# Altium project MEGAphone.PrjPcb (part 1 of 2)
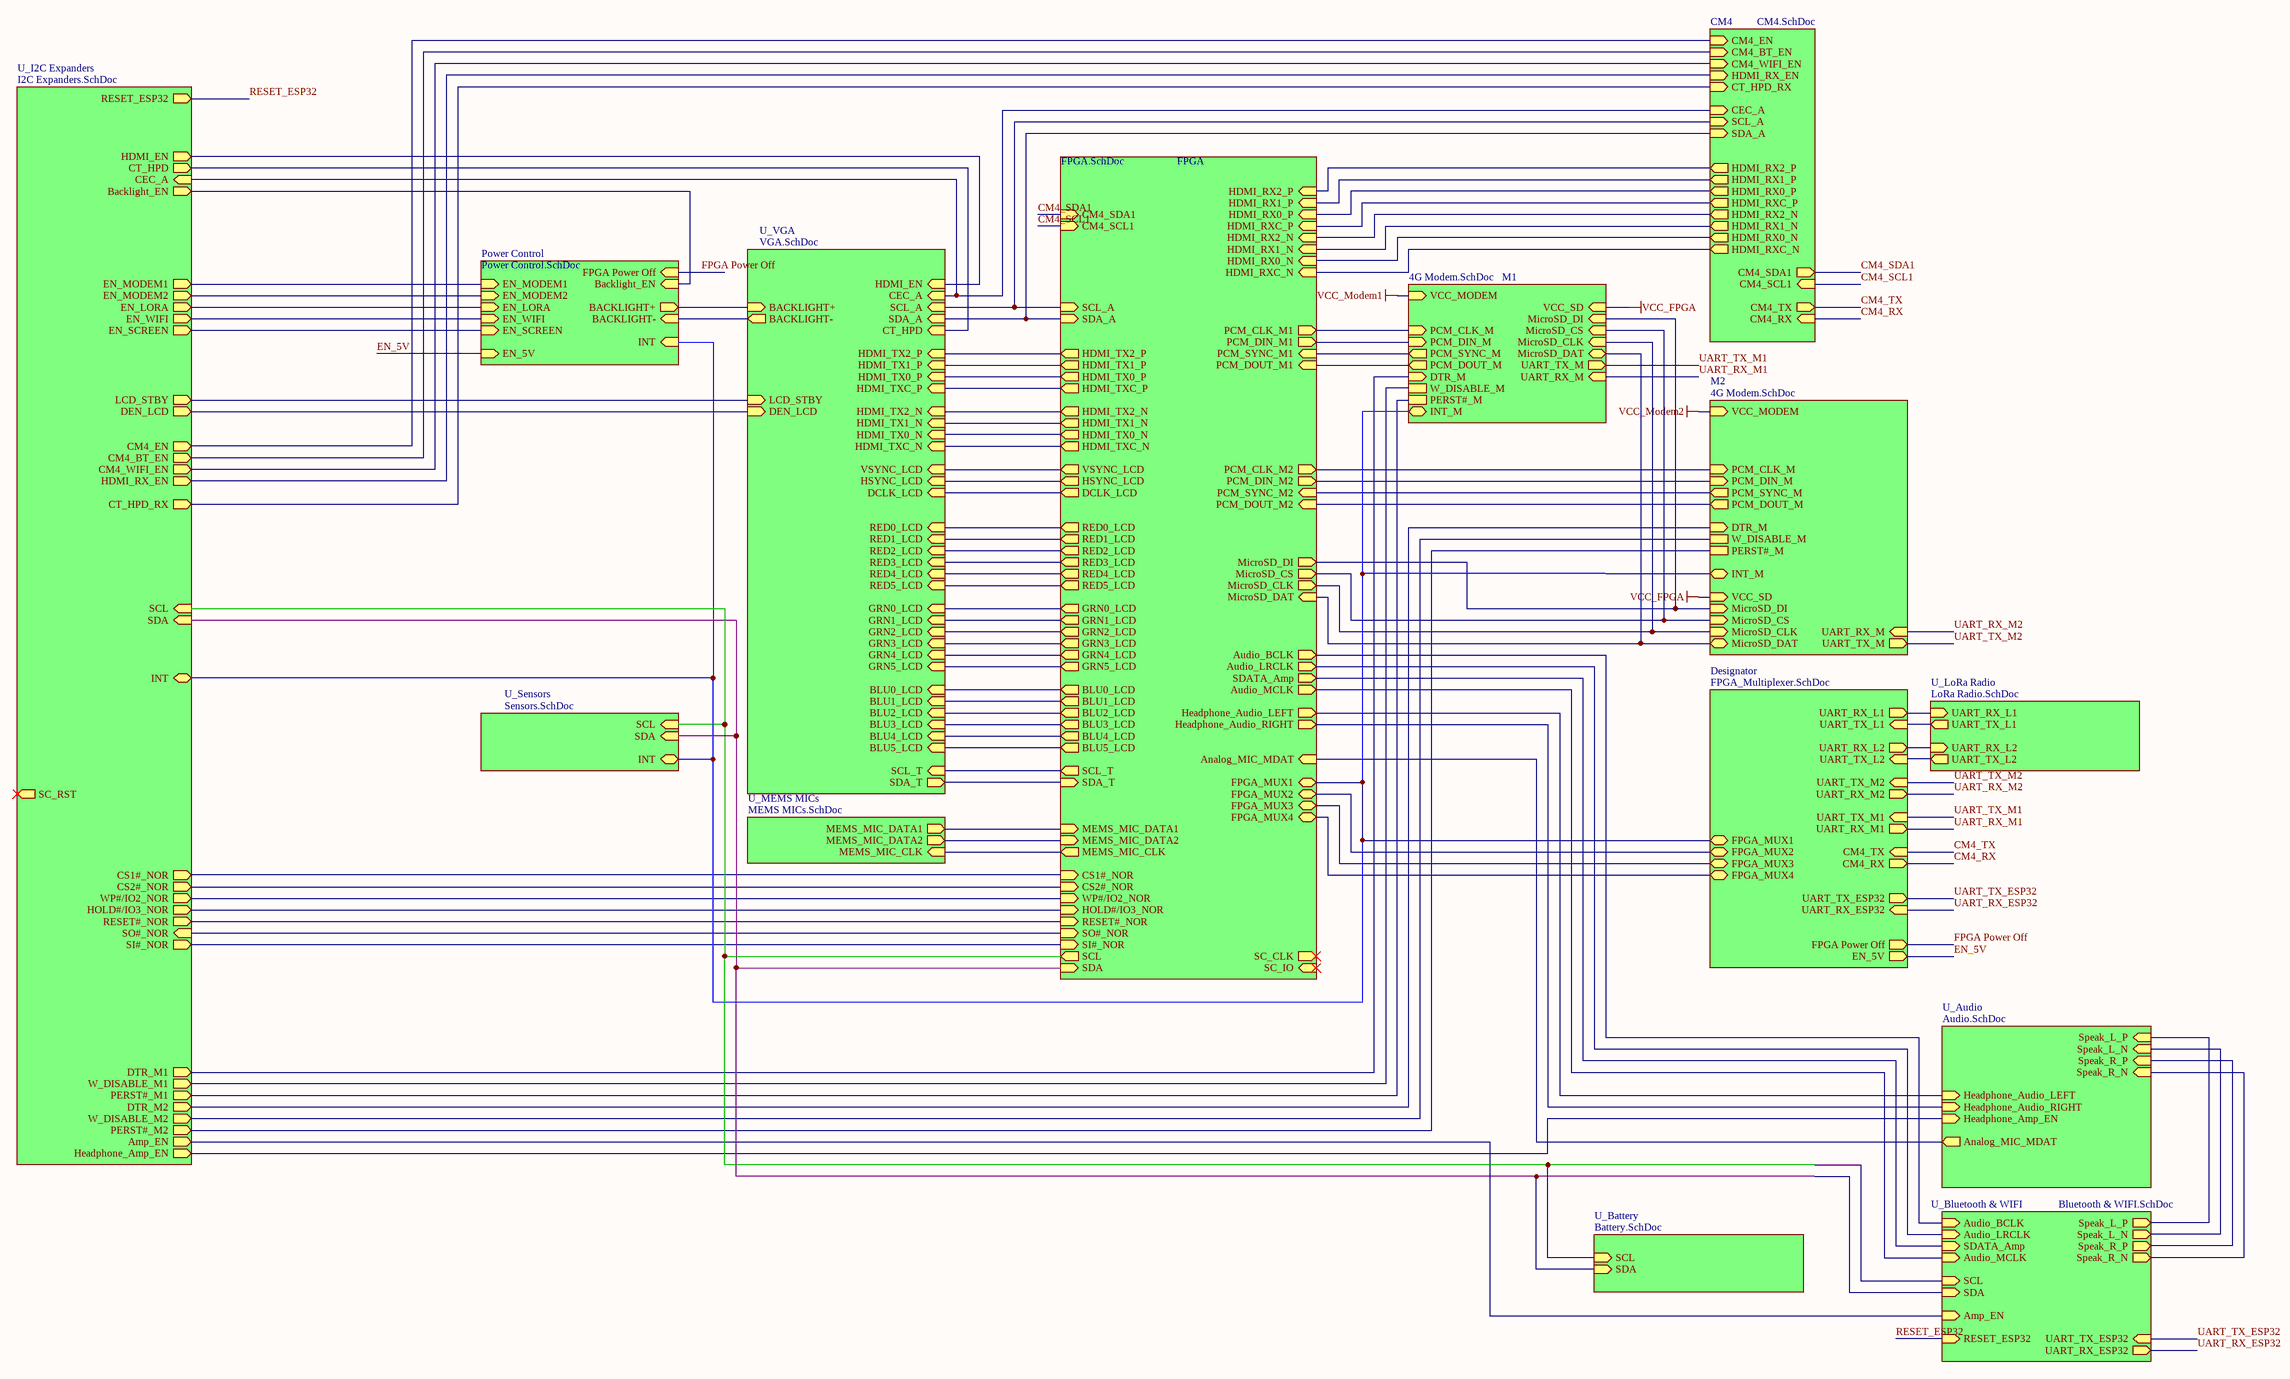
[diagram p0: MEGAphone Overview.SchDoc]
17 sheets, 319 parts. Net scope: hierarchical (ports join the sheet entries above them; power ports are global).
Board file: MEGAphone.PcbDoc
Sheets:
  MEGAphone Overview.SchDoc
    FPGA = FPGA.SchDoc
    U_VGA = VGA.SchDoc
    U_Battery = Battery.SchDoc
    Power Control = Power Control.SchDoc
      PS1 = PowerSupply.SchDoc
      PS2 = PowerSupply.SchDoc
      PS3 = PowerSupply.SchDoc
      PS5 = PowerSupply.SchDoc
      PS6 = PowerSupply.SchDoc
      PS7 5V = PowerSupply5V.SchDoc
      PS4 = PowerSupply5V.SchDoc
    U_I2C Expanders = I2C Expanders.SchDoc
    U_MEMS MICs = MEMS MICs.SchDoc
    U_Audio = Audio.SchDoc
      FA = Headphone Filter.SchDoc
      FB = Headphone Filter.SchDoc
    M1 = 4G Modem.SchDoc
    M2 = 4G Modem.SchDoc
    U_LoRa Radio = LoRa Radio.SchDoc
    U_Bluetooth & WIFI = Bluetooth & WIFI.SchDoc
    U_Sensors = Sensors.SchDoc
    CM4 = CM4.SchDoc
    Designator = FPGA_Multiplexer.SchDoc

## Sheet MEGAphone Overview.SchDoc: Mega Phone
size A2; DrawnBy: D Kleiss; Organization: Flinders University; Address1: College of Science & Engineering; Address2: Engineering Services Room 3.22; Address3: 1284 South Rd; Address4: SA 5042; DocumentNumber: A4284; Revision: 1; SheetNumber: 1; SheetTotal: 1; ProjectName: Mega Phone

### Sub-sheets
CM4 = CM4.SchDoc: HDMI_RXC_N (out), HDMI_RX0_N (out), HDMI_RX1_N (out), HDMI_RX2_N (out), HDMI_RX0_P (out), HDMI_RX2_P (out), HDMI_RX1_P (out), HDMI_RXC_P (out), CM4_RX (in), CM4_TX (out), SDA_A (in), SCL_A (in), CEC_A (in), CM4_EN (in), CM4_BT_EN (in), CM4_WIFI_EN (in), HDMI_RX_EN (in), CT_HPD_RX (in), CM4_SDA1 (out), CM4_SCL1 (in)
Designator = FPGA_Multiplexer.SchDoc: FPGA_MUX1 (bidir), FPGA_MUX2 (bidir), FPGA_MUX3 (bidir), FPGA_MUX4 (bidir), UART_RX_L1 (out), UART_TX_L1 (in), UART_RX_L2 (out), UART_TX_L2 (in), UART_TX_M2 (in), UART_RX_M2 (out), UART_TX_M1 (in), UART_RX_M1 (out), CM4_RX (out), CM4_TX (in), UART_TX_ESP32 (out), UART_RX_ESP32 (in), FPGA Power Off (out), EN_5V (out)
FPGA = FPGA.SchDoc: DCLK_LCD (out), HSYNC_LCD (out), BLU0_LCD (out), BLU1_LCD (out), BLU2_LCD (out), BLU3_LCD (out), BLU4_LCD (out), BLU5_LCD (out), GRN0_LCD (out), GRN1_LCD (out), GRN2_LCD (out), GRN3_LCD (out), GRN4_LCD (out), GRN5_LCD (out), Audio_MCLK (out), Analog_MIC_MDAT (in), Audio_BCLK (out), Audio_LRCLK (out), VSYNC_LCD (out), RED0_LCD (out), RED1_LCD (out), RED2_LCD (out), RED3_LCD (out), RED4_LCD (out), RED5_LCD (out), PCM_CLK_M1 (out), PCM_DOUT_M1 (in), PCM_DIN_M1 (out), PCM_SYNC_M1 (in), PCM_CLK_M2 (out), PCM_DOUT_M2 (in), PCM_DIN_M2 (out), PCM_SYNC_M2 (in), Headphone_Audio_RIGHT (out), Headphone_Audio_LEFT (out), MEMS_MIC_DATA2 (in), MEMS_MIC_DATA1 (in), MEMS_MIC_CLK (out), SDATA_Amp (out), SC_CLK (out), SC_IO (in), SDA (in), SCL (out), SDA_T (in), SCL_T (out), MicroSD_CS (out), MicroSD_DAT (in), MicroSD_CLK (out), MicroSD_DI (out), CS1#_NOR (in), HOLD#/IO3_NOR (in), RESET#_NOR (in), WP#/IO2_NOR (in), CS2#_NOR (in), HDMI_TXC_N (out), HDMI_TX0_N (out), HDMI_TX1_N (out), HDMI_TX2_N (out), HDMI_TX0_P (out), HDMI_TX2_P (out), HDMI_TX1_P (out), SDA_A (in), SCL_A (in), HDMI_TXC_P (out), HDMI_RXC_N (in), HDMI_RX0_N (in), HDMI_RX1_N (in), HDMI_RX2_N (in), HDMI_RX0_P (in), HDMI_RX2_P (in), HDMI_RX1_P (in), HDMI_RXC_P (in), SI#_NOR (in), SO#_NOR (in), FPGA_MUX1 (bidir), FPGA_MUX2 (bidir), FPGA_MUX3 (bidir), FPGA_MUX4 (bidir), CM4_SDA1 (in), CM4_SCL1 (in)
M1 = 4G Modem.SchDoc: UART_RX_M (in), UART_TX_M (out), DTR_M (in), PCM_CLK_M (in), PCM_DOUT_M (out), PCM_DIN_M (in), PCM_SYNC_M (out), W_DISABLE_M, PERST#_M, INT_M (bidir), MicroSD_CLK (in), MicroSD_DI (in), MicroSD_DAT (bidir), MicroSD_CS (in), VCC_MODEM (in), VCC_SD (in)
M2 = 4G Modem.SchDoc: UART_RX_M (in), UART_TX_M (out), DTR_M (in), PCM_CLK_M (in), PCM_DOUT_M (out), PCM_DIN_M (in), PCM_SYNC_M (out), W_DISABLE_M, PERST#_M, INT_M (bidir), MicroSD_CLK (in), MicroSD_DI (in), MicroSD_DAT (bidir), MicroSD_CS (in), VCC_MODEM (in), VCC_SD (in)
Power Control = Power Control.SchDoc: FPGA Power Off (in), INT (in), EN_MODEM1 (in), EN_MODEM2 (in), EN_LORA (in), EN_WIFI (in), EN_SCREEN (in), BACKLIGHT+ (out), BACKLIGHT- (in), Backlight_EN (in), EN_5V (in)
U_Audio = Audio.SchDoc: Analog_MIC_MDAT (out), Headphone_Amp_EN (in), Headphone_Audio_LEFT (in), Headphone_Audio_RIGHT (in), Speak_L_P (in), Speak_L_N (in), Speak_R_P (in), Speak_R_N (in)
U_Battery = Battery.SchDoc: SCL (in), SDA (in)
U_Bluetooth & WIFI = Bluetooth & WIFI.SchDoc: UART_RX_ESP32 (out), UART_TX_ESP32 (in), RESET_ESP32 (in), Speak_L_P (out), Speak_L_N (out), Speak_R_P (out), Speak_R_N (out), Audio_BCLK (in), Audio_LRCLK (in), SDATA_Amp (in), Audio_MCLK (in), SCL (in), SDA (in), Amp_EN (in)
U_I2C Expanders = I2C Expanders.SchDoc: HOLD#/IO3_NOR (out), RESET#_NOR (out), CS2#_NOR (out), CS1#_NOR (out), WP#/IO2_NOR (out), DTR_M1 (out), PERST#_M1 (out), DTR_M2 (out), PERST#_M2 (out), W_DISABLE_M2 (out), W_DISABLE_M1 (out), Headphone_Amp_EN (out), EN_MODEM1 (out), EN_MODEM2 (out), EN_LORA (out), EN_WIFI (out), EN_SCREEN (out), INT (bidir), SCL (in), SC_RST (out), SDA (in), LCD_STBY (out), CM4_EN (out), CM4_BT_EN (out), CM4_WIFI_EN (out), HDMI_RX_EN (out), HDMI_EN (out), CT_HPD (out), CEC_A (in), Backlight_EN (out), DEN_LCD (out), RESET_ESP32 (out), CT_HPD_RX (out), SI#_NOR (out), SO#_NOR (in), Amp_EN (out)
U_LoRa Radio = LoRa Radio.SchDoc: UART_RX_L1 (in), UART_TX_L1 (out), UART_RX_L2 (in), UART_TX_L2 (out)
U_MEMS MICs = MEMS MICs.SchDoc: MEMS_MIC_DATA1 (out), MEMS_MIC_DATA2 (out), MEMS_MIC_CLK (in)
U_Sensors = Sensors.SchDoc: SDA (in), SCL (in), INT (bidir)
U_VGA = VGA.SchDoc: DCLK_LCD (in), DEN_LCD (in), HSYNC_LCD (in), BLU0_LCD (in), BLU1_LCD (in), BLU2_LCD (in), BLU3_LCD (in), BLU4_LCD (in), BLU5_LCD (in), GRN0_LCD (in), GRN1_LCD (in), GRN2_LCD (in), GRN3_LCD (in), GRN4_LCD (in), GRN5_LCD (in), VSYNC_LCD (in), RED0_LCD (in), RED1_LCD (in), RED2_LCD (in), RED3_LCD (in), RED4_LCD (in), RED5_LCD (in), BACKLIGHT- (out), BACKLIGHT+ (in), SCL_T (in), SDA_T (out), LCD_STBY (in), HDMI_TXC_N (in), HDMI_TX0_N (in), HDMI_TX1_N (in), HDMI_TX2_N (in), HDMI_TXC_P (in), HDMI_TX0_P (in), HDMI_TX2_P (in), HDMI_TX1_P (in), CT_HPD (in), SDA_A (in), SCL_A (in), CEC_A (in), HDMI_EN (in)

### Nets
VCC_FPGA: sheet M1/VCC_SD, sheet M2/VCC_SD
CEC_A: sheet U_VGA/CEC_A, sheet U_I2C Expanders/CEC_A, sheet CM4/CEC_A
CM4_RX: sheet CM4/CM4_RX, sheet Designator/CM4_RX
CM4_SCL1: sheet FPGA/CM4_SCL1, sheet CM4/CM4_SCL1
CM4_SDA1: sheet FPGA/CM4_SDA1, sheet CM4/CM4_SDA1
CM4_TX: sheet CM4/CM4_TX, sheet Designator/CM4_TX
CT_HPD: sheet U_VGA/CT_HPD, sheet U_I2C Expanders/CT_HPD
EN_5V: sheet Power Control/EN_5V, sheet Designator/EN_5V
FPGA Power Off: sheet Power Control/FPGA Power Off, sheet Designator/FPGA Power Off
HDMI_EN: sheet U_VGA/HDMI_EN, sheet U_I2C Expanders/HDMI_EN
HDMI_TX0_N: sheet FPGA/HDMI_TX0_N, sheet U_VGA/HDMI_TX0_N
HDMI_TX0_P: sheet FPGA/HDMI_TX0_P, sheet U_VGA/HDMI_TX0_P
HDMI_TX1_N: sheet FPGA/HDMI_TX1_N, sheet U_VGA/HDMI_TX1_N
HDMI_TX1_P: sheet FPGA/HDMI_TX1_P, sheet U_VGA/HDMI_TX1_P
HDMI_TX2_N: sheet FPGA/HDMI_TX2_N, sheet U_VGA/HDMI_TX2_N
HDMI_TX2_P: sheet FPGA/HDMI_TX2_P, sheet U_VGA/HDMI_TX2_P
HDMI_TXC_N: sheet FPGA/HDMI_TXC_N, sheet U_VGA/HDMI_TXC_N
HDMI_TXC_P: sheet FPGA/HDMI_TXC_P, sheet U_VGA/HDMI_TXC_P
INT: sheet FPGA/FPGA_MUX1, sheet Power Control/INT, sheet U_I2C Expanders/INT, sheet M1/INT_M, sheet M2/INT_M, sheet U_Sensors/INT, sheet Designator/FPGA_MUX1
RESET_ESP32: sheet U_I2C Expanders/RESET_ESP32, sheet U_Bluetooth & WIFI/RESET_ESP32
SCL: sheet FPGA/SCL, sheet U_Battery/SCL, sheet U_I2C Expanders/SCL, sheet U_Bluetooth & WIFI/SCL, sheet U_Sensors/SCL
SCL_A: sheet FPGA/SCL_A, sheet U_VGA/SCL_A, sheet CM4/SCL_A
SDA: sheet FPGA/SDA, sheet U_Battery/SDA, sheet U_I2C Expanders/SDA, sheet U_Bluetooth & WIFI/SDA, sheet U_Sensors/SDA
SDA_A: sheet FPGA/SDA_A, sheet U_VGA/SDA_A, sheet CM4/SDA_A
UART_RX_ESP32: sheet U_Bluetooth & WIFI/UART_RX_ESP32, sheet Designator/UART_RX_ESP32
UART_RX_M1: sheet M1/UART_RX_M, sheet Designator/UART_RX_M1
UART_RX_M2: sheet M2/UART_RX_M, sheet Designator/UART_RX_M2
UART_TX_ESP32: sheet U_Bluetooth & WIFI/UART_TX_ESP32, sheet Designator/UART_TX_ESP32
UART_TX_M1: sheet M1/UART_TX_M, sheet Designator/UART_TX_M1
UART_TX_M2: sheet M2/UART_TX_M, sheet Designator/UART_TX_M2
NetC36_1: sheet U_VGA/BACKLIGHT+, sheet Power Control/BACKLIGHT+
NetC39_1: sheet U_VGA/BACKLIGHT-, sheet Power Control/BACKLIGHT-
NetCM1_89: sheet U_I2C Expanders/CM4_WIFI_EN, sheet CM4/CM4_WIFI_EN
NetCM1_91: sheet U_I2C Expanders/CM4_BT_EN, sheet CM4/CM4_BT_EN
NetCM1_99: sheet U_I2C Expanders/CM4_EN, sheet CM4/CM4_EN
NetCM1_170: sheet FPGA/HDMI_RX2_P, sheet CM4/HDMI_RX2_P
NetCM1_172: sheet FPGA/HDMI_RX2_N, sheet CM4/HDMI_RX2_N
NetCM1_176: sheet FPGA/HDMI_RX1_P, sheet CM4/HDMI_RX1_P
NetCM1_178: sheet FPGA/HDMI_RX1_N, sheet CM4/HDMI_RX1_N
NetCM1_182: sheet FPGA/HDMI_RX0_P, sheet CM4/HDMI_RX0_P
NetCM1_184: sheet FPGA/HDMI_RX0_N, sheet CM4/HDMI_RX0_N
NetCM1_188: sheet FPGA/HDMI_RXC_P, sheet CM4/HDMI_RXC_P
NetCM1_190: sheet FPGA/HDMI_RXC_N, sheet CM4/HDMI_RXC_N
NetESP1_5: sheet U_I2C Expanders/Amp_EN, sheet U_Bluetooth & WIFI/Amp_EN
NetESP1_8: sheet U_Audio/Speak_L_P, sheet U_Bluetooth & WIFI/Speak_L_P
NetESP1_9: sheet FPGA/Audio_BCLK, sheet U_Bluetooth & WIFI/Audio_BCLK
NetESP1_10: sheet U_Audio/Speak_L_N, sheet U_Bluetooth & WIFI/Speak_L_N
NetESP1_11: sheet FPGA/Audio_LRCLK, sheet U_Bluetooth & WIFI/Audio_LRCLK
NetESP1_12: sheet U_Audio/Speak_R_P, sheet U_Bluetooth & WIFI/Speak_R_P
NetESP1_13: sheet FPGA/SDATA_Amp, sheet U_Bluetooth & WIFI/SDATA_Amp
NetESP1_14: sheet U_Audio/Speak_R_N, sheet U_Bluetooth & WIFI/Speak_R_N
NetESP1_15: sheet FPGA/Audio_MCLK, sheet U_Bluetooth & WIFI/Audio_MCLK
NetJ1_M1_5: sheet FPGA/MicroSD_CLK, sheet M1/MicroSD_CLK, sheet M2/MicroSD_CLK
NetJ1_M1_8: sheet FPGA/MicroSD_DAT, sheet FPGA/MicroSD_DI, sheet M1/MicroSD_DI, sheet M1/MicroSD_DAT, sheet M2/MicroSD_DI, sheet M2/MicroSD_DAT
NetJ1_M1_18: sheet FPGA/MicroSD_CS, sheet M1/MicroSD_CS, sheet M2/MicroSD_CS
NetP3_1: sheet FPGA/SCL_T, sheet U_VGA/SCL_T
NetP3_2: sheet FPGA/SDA_T, sheet U_VGA/SDA_T
NetR17_FA_2: sheet FPGA/Headphone_Audio_LEFT, sheet U_Audio/Headphone_Audio_LEFT
NetR17_FB_2: sheet FPGA/Headphone_Audio_RIGHT, sheet U_Audio/Headphone_Audio_RIGHT
NetR39_1: sheet FPGA/MEMS_MIC_DATA1, sheet U_MEMS MICs/MEMS_MIC_DATA1
NetR41_1: sheet FPGA/MEMS_MIC_CLK, sheet U_MEMS MICs/MEMS_MIC_CLK
NetR42_1: sheet FPGA/MEMS_MIC_DATA2, sheet U_MEMS MICs/MEMS_MIC_DATA2
NetR76_2: sheet U_VGA/LCD_STBY, sheet U_I2C Expanders/LCD_STBY
NetRF1_7: sheet U_LoRa Radio/UART_RX_L2, sheet Designator/UART_RX_L2
NetRF1_9: sheet U_LoRa Radio/UART_TX_L2, sheet Designator/UART_TX_L2
NetRF2_7: sheet U_LoRa Radio/UART_RX_L1, sheet Designator/UART_RX_L1
NetRF2_9: sheet U_LoRa Radio/UART_TX_L1, sheet Designator/UART_TX_L1
NetS5_1: sheet Power Control/EN_MODEM1, sheet U_I2C Expanders/EN_MODEM1
NetS7_1: sheet Power Control/EN_MODEM2, sheet U_I2C Expanders/EN_MODEM2
NetS9_1: sheet Power Control/EN_LORA, sheet U_I2C Expanders/EN_LORA
NetS10_1: sheet Power Control/EN_WIFI, sheet U_I2C Expanders/EN_WIFI
NetU1_M1_20: sheet U_I2C Expanders/W_DISABLE_M1, sheet M1/W_DISABLE_M
NetU1_M1_22: sheet U_I2C Expanders/PERST#_M1, sheet M1/PERST#_M
NetU1_M1_31: sheet U_I2C Expanders/DTR_M1, sheet M1/DTR_M
NetU1_M2_20: sheet U_I2C Expanders/W_DISABLE_M2, sheet M2/W_DISABLE_M
NetU1_M2_22: sheet U_I2C Expanders/PERST#_M2, sheet M2/PERST#_M
NetU1_M2_31: sheet U_I2C Expanders/DTR_M2, sheet M2/DTR_M
NetU4_M1_11: sheet FPGA/PCM_SYNC_M1, sheet M1/PCM_SYNC_M
NetU4_M1_12: sheet FPGA/PCM_DIN_M1, sheet M1/PCM_DIN_M
NetU4_M1_13: sheet FPGA/PCM_DOUT_M1, sheet M1/PCM_DOUT_M
NetU4_M1_14: sheet FPGA/PCM_CLK_M1, sheet M1/PCM_CLK_M
NetU4_M2_11: sheet FPGA/PCM_SYNC_M2, sheet M2/PCM_SYNC_M
NetU4_M2_12: sheet FPGA/PCM_DIN_M2, sheet M2/PCM_DIN_M
NetU4_M2_13: sheet FPGA/PCM_DOUT_M2, sheet M2/PCM_DOUT_M
NetU4_M2_14: sheet FPGA/PCM_CLK_M2, sheet M2/PCM_CLK_M
NetU5_6: sheet FPGA/Analog_MIC_MDAT, sheet U_Audio/Analog_MIC_MDAT
NetU9_10A: sheet FPGA/FPGA_MUX2, sheet Designator/FPGA_MUX2
NetU9_11A: sheet FPGA/FPGA_MUX3, sheet Designator/FPGA_MUX3
NetU9_12A: sheet FPGA/FPGA_MUX4, sheet Designator/FPGA_MUX4
NetU9_12B: sheet FPGA/VSYNC_LCD, sheet U_VGA/VSYNC_LCD
NetU9_13B: sheet FPGA/HSYNC_LCD, sheet U_VGA/HSYNC_LCD
NetU9_14B: sheet FPGA/DCLK_LCD, sheet U_VGA/DCLK_LCD
NetU9_15B: sheet FPGA/BLU5_LCD, sheet U_VGA/BLU5_LCD
NetU9_16B: sheet FPGA/BLU4_LCD, sheet U_VGA/BLU4_LCD
NetU9_17B: sheet FPGA/BLU3_LCD, sheet U_VGA/BLU3_LCD
NetU9_18B: sheet FPGA/BLU2_LCD, sheet U_VGA/BLU2_LCD
NetU9_19B: sheet FPGA/BLU1_LCD, sheet U_VGA/BLU1_LCD
NetU9_20B: sheet FPGA/BLU0_LCD, sheet U_VGA/BLU0_LCD
NetU9_21B: sheet FPGA/GRN5_LCD, sheet U_VGA/GRN5_LCD
NetU9_22B: sheet FPGA/GRN4_LCD, sheet U_VGA/GRN4_LCD
NetU9_23B: sheet FPGA/GRN3_LCD, sheet U_VGA/GRN3_LCD
NetU9_24B: sheet FPGA/GRN2_LCD, sheet U_VGA/GRN2_LCD
NetU9_25B: sheet FPGA/GRN1_LCD, sheet U_VGA/GRN1_LCD
NetU9_26B: sheet FPGA/GRN0_LCD, sheet U_VGA/GRN0_LCD
NetU9_27B: sheet FPGA/RED5_LCD, sheet U_VGA/RED5_LCD
NetU9_28B: sheet FPGA/RED4_LCD, sheet U_VGA/RED4_LCD
NetU9_29B: sheet FPGA/RED3_LCD, sheet U_VGA/RED3_LCD
NetU9_30B: sheet FPGA/RED2_LCD, sheet U_VGA/RED2_LCD
NetU9_31B: sheet FPGA/RED1_LCD, sheet U_VGA/RED1_LCD
NetU9_32B: sheet FPGA/RED0_LCD, sheet U_VGA/RED0_LCD
NetU10_1: sheet FPGA/HOLD#/IO3_NOR, sheet U_I2C Expanders/HOLD#/IO3_NOR
NetU10_3: sheet FPGA/RESET#_NOR, sheet U_I2C Expanders/RESET#_NOR
NetU10_6: sheet FPGA/CS2#_NOR, sheet U_I2C Expanders/CS2#_NOR
NetU10_7: sheet FPGA/CS1#_NOR, sheet U_I2C Expanders/CS1#_NOR
NetU10_8: sheet FPGA/SO#_NOR, sheet U_I2C Expanders/SO#_NOR
NetU10_9: sheet FPGA/WP#/IO2_NOR, sheet U_I2C Expanders/WP#/IO2_NOR
NetU10_15: sheet FPGA/SI#_NOR, sheet U_I2C Expanders/SI#_NOR
NetU11_FA_5: sheet U_I2C Expanders/Headphone_Amp_EN, sheet U_Audio/Headphone_Amp_EN
NetU12_10: sheet U_I2C Expanders/HDMI_RX_EN, sheet CM4/HDMI_RX_EN
NetU13_7: sheet U_VGA/DEN_LCD, sheet U_I2C Expanders/DEN_LCD
NetU13_8: sheet Power Control/Backlight_EN, sheet U_I2C Expanders/Backlight_EN
NetU14_8: sheet Power Control/EN_SCREEN, sheet U_I2C Expanders/EN_SCREEN
NetU14_19: sheet U_I2C Expanders/CT_HPD_RX, sheet CM4/CT_HPD_RX

### Notes on the sheet
- Title
- Size:
- Date:
- File:
- A2
- Number:
- Time:
- Revision:
- Sheet
- of

## Sheet FPGA.SchDoc: MEGAPHONE FPGA
size A3; SheetNumber: 2
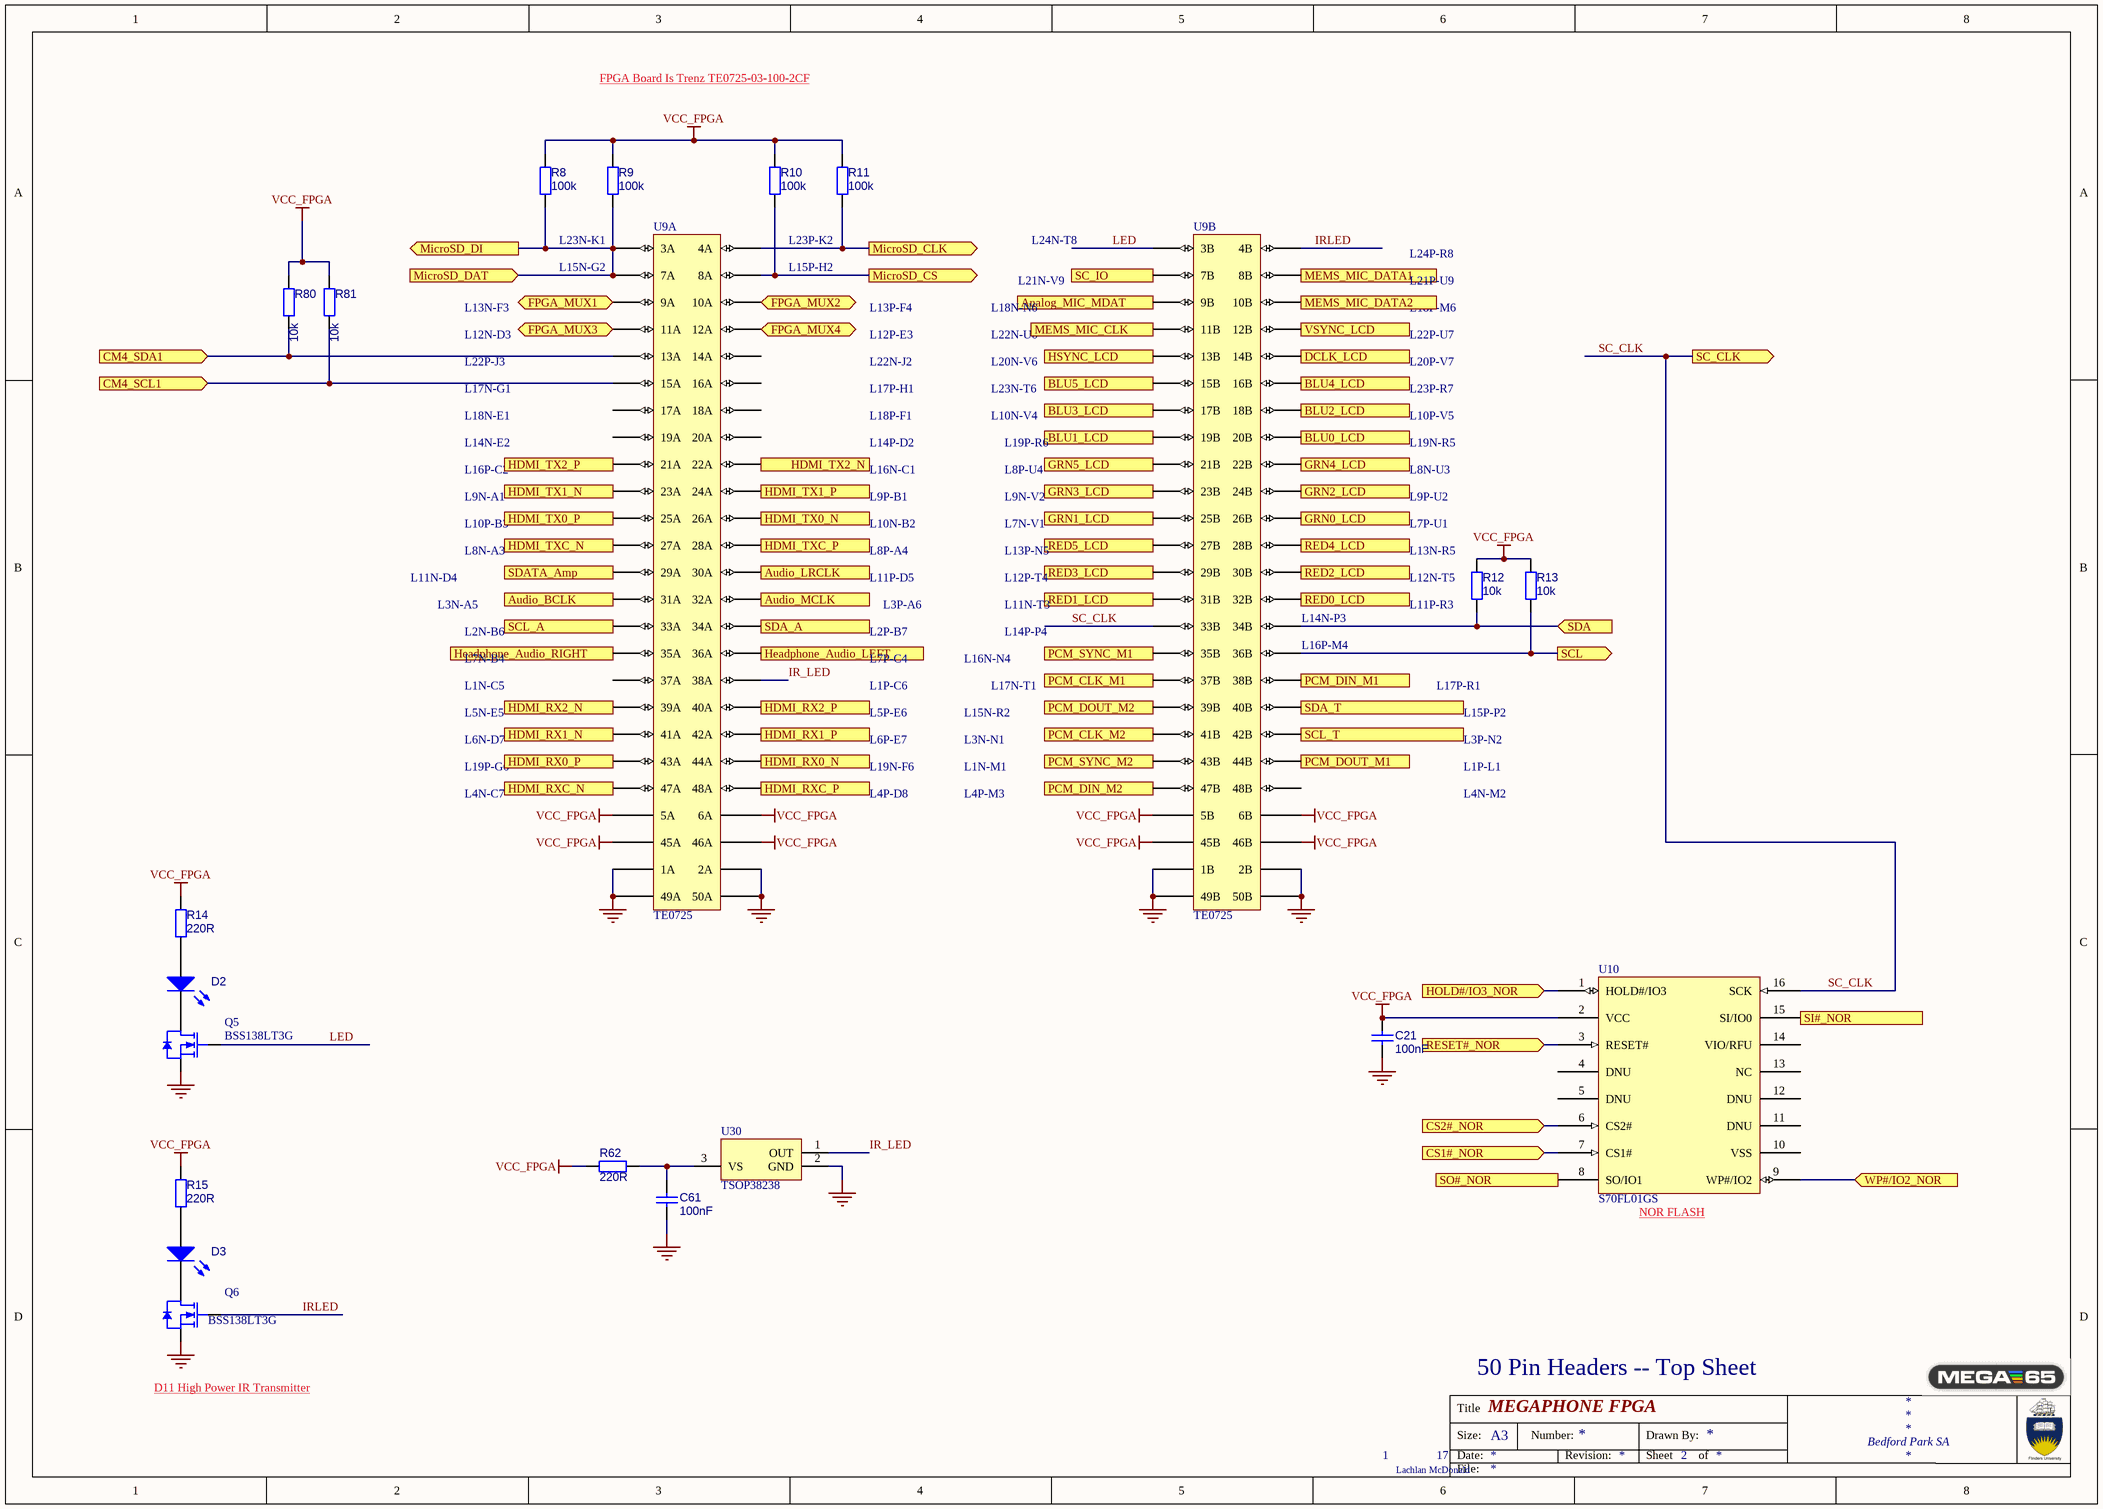
[diagram p1: FPGA.SchDoc]

### Parts
C21  100nF  [0603_CAP UF HD]
C61  100nF  [0603_CAP UF HD]
D2  (no value)  [LED 3mm Red]
D3  (no value)  [LED 3mm Red]
Q5  BSS138LT3G  [SOT-23]
Q6  BSS138LT3G  [SOT-23]
R8  100k  [0603-RESISTOR HD]
R9  100k  [0603-RESISTOR HD]
R10  100k  [0603-RESISTOR HD]
R11  100k  [0603-RESISTOR HD]
R12  10k  [0603-RESISTOR HD]
R13  10k  [0603-RESISTOR HD]
R14  220R  [0603-RESISTOR HD]
R15  220R  [0603-RESISTOR HD]
R62  220R  [0603-RESISTOR HD]
R80  10k  [0603-RESISTOR HD]
R81  10k  [0603-RESISTOR HD]
U9  TE0725  [Trenz TE-0725]  (parts A,B of 2)
U10  S70FL01GS  [S70FL01GS]
U30  TSOP38238  [VISH-TSOP38238]

### Ports
Analog_MIC_MDAT (in), Audio_BCLK (out), Audio_LRCLK (out), Audio_MCLK (out), BLU0_LCD (out), BLU1_LCD (out), BLU2_LCD (out), BLU3_LCD (out), BLU4_LCD (out), BLU5_LCD (out), CM4_SCL1 (in), CM4_SDA1 (in), CS1#_NOR (in), CS2#_NOR (in), DCLK_LCD (out), FPGA_MUX1 (bidir), FPGA_MUX2 (bidir), FPGA_MUX3 (bidir), FPGA_MUX4 (bidir), GRN0_LCD (out), GRN1_LCD (out), GRN2_LCD (out), GRN3_LCD (out), GRN4_LCD (out), GRN5_LCD (out), HDMI_RX0_N (in), HDMI_RX0_P (in), HDMI_RX1_N (in), HDMI_RX1_P (in), HDMI_RX2_N (in), HDMI_RX2_P (in), HDMI_RXC_N (in), HDMI_RXC_P (in), HDMI_TX0_N (out), HDMI_TX0_P (out), HDMI_TX1_N (out), HDMI_TX1_P (out), HDMI_TX2_N (out), HDMI_TX2_P (out), HDMI_TXC_N (out), HDMI_TXC_P (out), Headphone_Audio_LEFT (out), Headphone_Audio_RIGHT (out), HOLD#/IO3_NOR (in), HSYNC_LCD (out), MEMS_MIC_CLK (out), MEMS_MIC_DATA1 (in), MEMS_MIC_DATA2 (in), MicroSD_CLK (out), MicroSD_CS (out), MicroSD_DAT (in), MicroSD_DI (out), PCM_CLK_M1 (out), PCM_CLK_M2 (out), PCM_DIN_M1 (out), PCM_DIN_M2 (out), PCM_DOUT_M1 (in), PCM_DOUT_M2 (in), PCM_SYNC_M1 (in), PCM_SYNC_M2 (in), RED0_LCD (out), RED1_LCD (out), RED2_LCD (out), RED3_LCD (out), RED4_LCD (out), RED5_LCD (out), RESET#_NOR (in), SC_CLK (out), SC_IO (in), SCL (out), SCL_A (out), SCL_T (out), SDA (in), SDA_A (out), SDA_T (in), SDATA_Amp (out), SI#_NOR (in), SO#_NOR (out), VSYNC_LCD (out), WP#/IO2_NOR (in)

### Nets
GND: C21.2 C61.2 Q5.2(S) Q6.2(S) U9.1A U9.1B U9.2A U9.2B U9.49A U9.49B U9.50A U9.50B U30.2(GND)
VCC_FPGA: C21.1 R8.1 R9.1 R10.1 R11.1 R12.1 R13.1 R14.1 R15.1 R62.1 R80.1 R81.1 U9.5A U9.5B U9.6A U9.6B U9.45A U9.45B U9.46A U9.46B U10.2(VCC)
CM4_SCL1: R81.2 U9.15A ; port CM4_SCL1
CM4_SDA1: R80.2 U9.13A ; port CM4_SDA1
HDMI_TX0_N: U9.26A ; port HDMI_TX0_N
HDMI_TX0_P: U9.25A ; port HDMI_TX0_P
HDMI_TX1_N: U9.23A ; port HDMI_TX1_N
HDMI_TX1_P: U9.24A ; port HDMI_TX1_P
HDMI_TX2_N: U9.22A ; port HDMI_TX2_N
HDMI_TX2_P: U9.21A ; port HDMI_TX2_P
HDMI_TXC_N: U9.27A ; port HDMI_TXC_N
HDMI_TXC_P: U9.28A ; port HDMI_TXC_P
INT: U9.9A ; port FPGA_MUX1
IR_LED: U9.38A U30.1(OUT)
IRLED: Q6.1(G) U9.4B
LED: Q5.1(G) U9.3B
SC_CLK: U9.33B U10.16(SCK) ; port SC_CLK
SCL: R13.2 U9.36B ; port SCL
SCL_A: U9.33A ; port SCL_A
SDA: R12.2 U9.34B ; port SDA
SDA_A: U9.34A ; port SDA_A
NetC61_1: C61.1 R62.2 U30.3(VS)
NetCM1_170: U9.40A ; port HDMI_RX2_P
NetCM1_172: U9.39A ; port HDMI_RX2_N
NetCM1_176: U9.42A ; port HDMI_RX1_P
NetCM1_178: U9.41A ; port HDMI_RX1_N
NetCM1_182: U9.43A ; port HDMI_RX0_P
NetCM1_184: U9.44A ; port HDMI_RX0_N
NetCM1_188: U9.48A ; port HDMI_RXC_P
NetCM1_190: U9.47A ; port HDMI_RXC_N
NetD2_A: D2.A R14.2
NetD2_K: D2.K Q5.3(D)
NetD3_A: D3.A R15.2
NetD3_K: D3.K Q6.3(D)
NetESP1_9: U9.31A ; port Audio_BCLK
NetESP1_11: U9.30A ; port Audio_LRCLK
NetESP1_13: U9.29A ; port SDATA_Amp
NetESP1_15: U9.32A ; port Audio_MCLK
NetJ1_M1_5: R11.2 U9.4A ; port MicroSD_CLK
NetJ1_M1_8: R8.2 R9.2 U9.3A U9.7A ; port MicroSD_DAT, port MicroSD_DI
NetJ1_M1_18: R10.2 U9.8A ; port MicroSD_CS
NetP3_1: U9.42B ; port SCL_T
NetP3_2: U9.40B ; port SDA_T
NetR17_FA_2: U9.36A ; port Headphone_Audio_LEFT
NetR17_FB_2: U9.35A ; port Headphone_Audio_RIGHT
NetR39_1: U9.8B ; port MEMS_MIC_DATA1
NetR41_1: U9.11B ; port MEMS_MIC_CLK
NetR42_1: U9.10B ; port MEMS_MIC_DATA2
NetU4_M1_11: U9.35B ; port PCM_SYNC_M1
NetU4_M1_12: U9.38B ; port PCM_DIN_M1
NetU4_M1_13: U9.44B ; port PCM_DOUT_M1
NetU4_M1_14: U9.37B ; port PCM_CLK_M1
NetU4_M2_11: U9.43B ; port PCM_SYNC_M2
NetU4_M2_12: U9.47B ; port PCM_DIN_M2
NetU4_M2_13: U9.39B ; port PCM_DOUT_M2
NetU4_M2_14: U9.41B ; port PCM_CLK_M2
NetU5_6: U9.9B ; port Analog_MIC_MDAT
NetU9_7B: U9.7B ; port SC_IO
NetU9_10A: U9.10A ; port FPGA_MUX2
NetU9_11A: U9.11A ; port FPGA_MUX3
NetU9_12A: U9.12A ; port FPGA_MUX4
NetU9_12B: U9.12B ; port VSYNC_LCD
NetU9_13B: U9.13B ; port HSYNC_LCD
NetU9_14B: U9.14B ; port DCLK_LCD
NetU9_15B: U9.15B ; port BLU5_LCD
NetU9_16B: U9.16B ; port BLU4_LCD
NetU9_17B: U9.17B ; port BLU3_LCD
NetU9_18B: U9.18B ; port BLU2_LCD
NetU9_19B: U9.19B ; port BLU1_LCD
NetU9_20B: U9.20B ; port BLU0_LCD
NetU9_21B: U9.21B ; port GRN5_LCD
NetU9_22B: U9.22B ; port GRN4_LCD
NetU9_23B: U9.23B ; port GRN3_LCD
NetU9_24B: U9.24B ; port GRN2_LCD
NetU9_25B: U9.25B ; port GRN1_LCD
NetU9_26B: U9.26B ; port GRN0_LCD
NetU9_27B: U9.27B ; port RED5_LCD
NetU9_28B: U9.28B ; port RED4_LCD
NetU9_29B: U9.29B ; port RED3_LCD
NetU9_30B: U9.30B ; port RED2_LCD
NetU9_31B: U9.31B ; port RED1_LCD
NetU9_32B: U9.32B ; port RED0_LCD
NetU10_1: U10.1(HOLD#/IO3) ; port HOLD#/IO3_NOR
NetU10_3: U10.3(RESET#) ; port RESET#_NOR
NetU10_6: U10.6(CS2#) ; port CS2#_NOR
NetU10_7: U10.7(CS1#) ; port CS1#_NOR
NetU10_8: U10.8(SO/IO1) ; port SO#_NOR
NetU10_9: U10.9(WP#/IO2) ; port WP#/IO2_NOR
NetU10_15: U10.15(SI/IO0) ; port SI#_NOR

Not connected (* = marked no-connect by the designer): U9 14A 16A 17A 18A 19A 20A 37A 48B; U10 4(DNU) 5(DNU) 10(VSS) 11(DNU) 12(DNU) 13(NC) 14(VIO/RFU)

### Notes on the sheet
- FPGA Board Is Trenz TE0725-03-100-2CF
- L23N-K1
- L23P-K2
- L24N-T8
- L13N-F3
- L15N-G2
- L15P-H2
- L13P-F4
- L18N-N6
- L21N-V9
- L24P-R8
- L21P-U9
- L18P-M6
- L12N-D3
- L22P-J3
- L12P-E3
- L22N-J2
- L22N-U6
- L20N-V6
- L22P-U7
- L20P-V7
- L17N-G1
- L18N-E1
- L14N-E2
- L17P-H1
- L18P-F1
- L14P-D2
- L23N-T6
- L10N-V4
- L19P-R6
- L23P-R7
- L10P-V5
- L19N-R5
- L16P-C2
- L9N-A1
- L16N-C1
- L9P-B1
- L8P-U4
- L9N-V2
- L8N-U3
- L9P-U2
- L11N-D4
- L10P-B3
- L8N-A3
- L10N-B2
- L8P-A4
- L11P-D5
- L7N-V1
- L13P-N5
- L12P-T4
- (near R12) L7P-U1
- (near R12) L13N-R5
- (near R12) L12N-T5
- L3N-A5
- L2N-B6
- L2P-B7
- L3P-A6
- L11N-T3
- L14P-P4
- (near U9) L14N-P3
- (near U9) L16P-M4
- (near R12) L11P-R3
- L7N-B4
- L1N-C5
- L5N-E5
- L7P-C4
- L1P-C6
- L5P-E6
- L16N-N4
- L15N-R2
- L17N-T1
- L17P-R1
- L15P-P2
- L6N-D7
- L19P-G6
- L6P-E7
- L19N-F6
- L3N-N1
- L1N-M1
- L3P-N2
- L1P-L1
- L4N-C7
- L4P-D8
- L4P-M3
- L4N-M2
- (near U10) NOR FLASH
- D11 High Power IR Transmitter
- 50 Pin Headers -- Top Sheet
- 1
- 17
- Lachlan McDonald
- Title
- Size:
- Date:
- A3
- Number:
- Revision:
- Sheet
- Drawn By:
- of
- Bedford Park SA
- File:

### Library data of the parts
C21 C61 = Cap: Capacitor; Value: 100nF
D2 D3 = LED: Manufacturer: *; Element 14 Part Number: *
Q5 Q6 = BSS138LT3G: Power MOSFET, 200 mA, 50 V, N-Channel, 3-Pin SOT-23, Pb-Free, Tape and Reel; Manufacturer: On Semiconductor; Element 14 Part Number: 1431319; Manufacturer Number: BSS138LT3G; Digikey Number: BSS138LT3GOSCT-ND
R8-R15 R62 R80 R81 = Resistor
  R8-R11: Value: 100k
  R12 R13 R80 R81: Value: 10k
  R14 R15 R62: Value: 220R
U9 = TRENZ TE0725: FPGA Module Xilinx Artix-7 100T, optical transceiver; Manufacturer: TE Connectivity; Manufacturer Number: 7-534206-5; Digikey Number: A32951-ND
U10 = NOR Flash: Manufacturer: S70FL01GSDPMFI010; Manufacturer Number: S70FL01GS; Digikey Number: S70FL01GSDPMFI010-ND
U30 = CMP-1666-00022-1: IR Receiver Modules for Remote Control System, 2.5 to 5.5 V, -25 to 85 degC, 3-Pin THD, RoHS, Bulk; Tolerance: 30ppm; ESR: 40 Ohm; Capacitance: 1.8E-11 f; Frequency: 24 MHz; Load Capacitance: 18 pF; DatasheetVersion: Rev. 1.5, 07/2016; REACH SVHC: No SVHC; Frequency Tolerance: 30ppm; ComponentLink2URL: http://www.vishay.com/docs/82491/tsop382.pdf; Mount: Surface Mount; Length: 0.197 inch; Min Operating Temperature: -20degC; Packaging: Tape and Reel; ComponentLink1URL: http://www.vishay.com/; Width: 0.126 inch; Height: 0.041 inch; PackageDescription: 3-Pin Through Hole Device, Body 5.00 x 4.80 mm, Pitch 2.54 mm; Max Operating Temperature: 70degC; Pins: 4; RoHSCompliant: True; Package Quantity: 1000; PackageReference: VISH-TSOP38238; ComponentLink2Description: Datasheet; ComponentLink1Description: Manufacturer URL; Resistance: 40 Ohm

## Sheet VGA.SchDoc
size A4
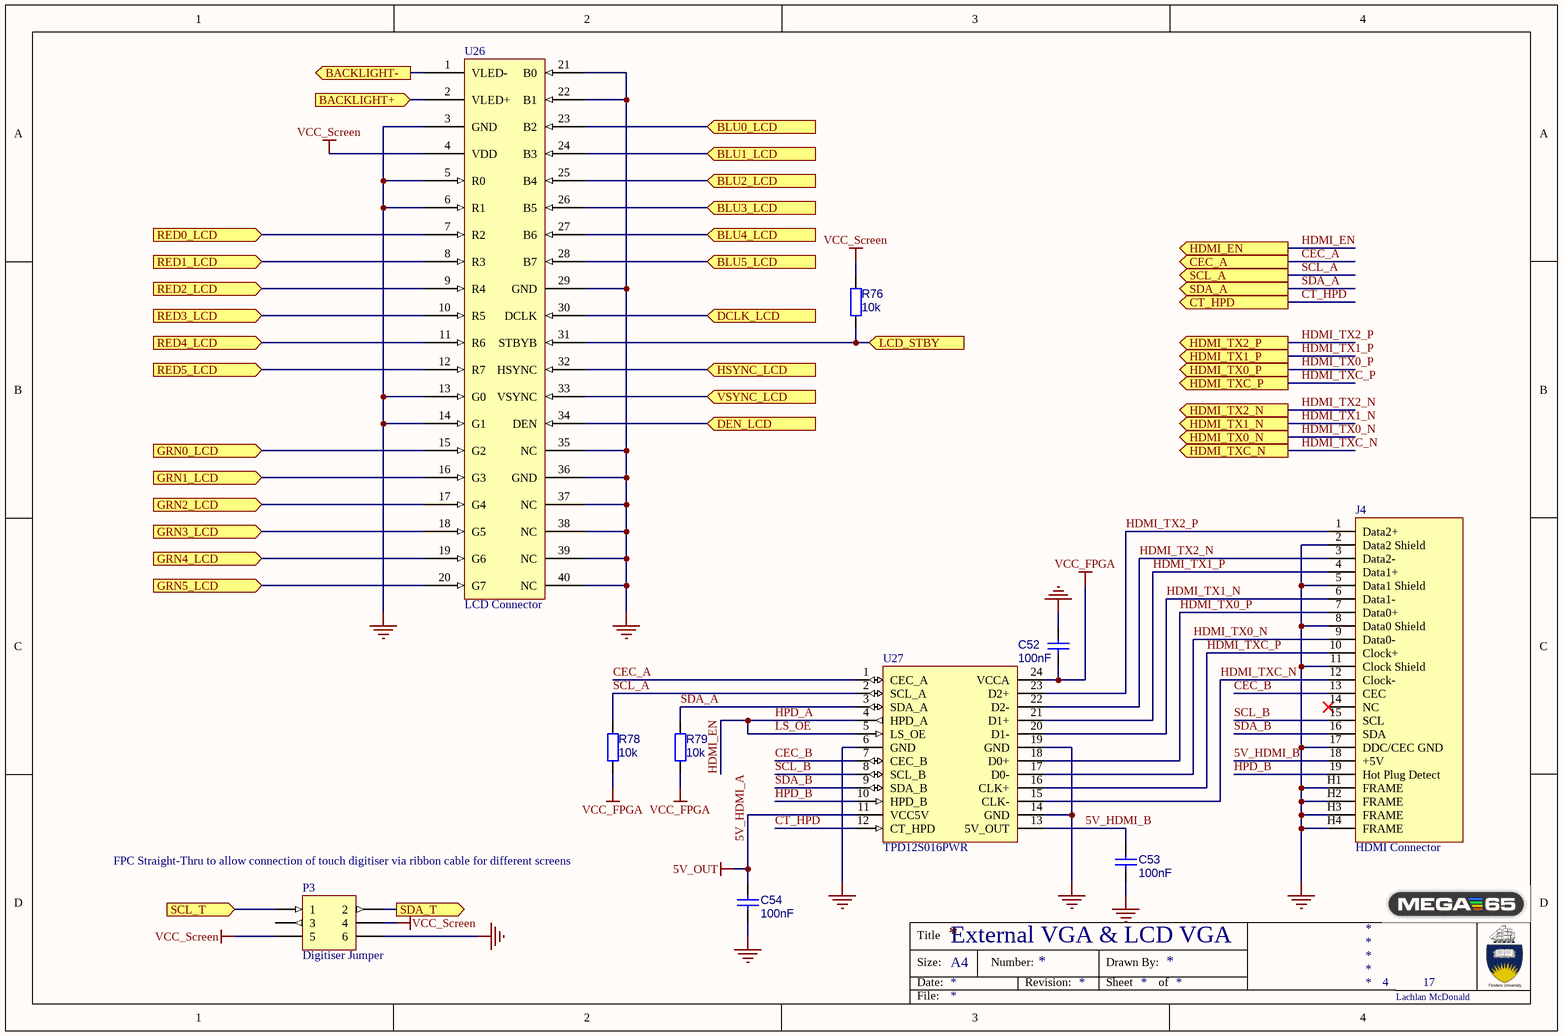
[diagram p2: VGA.SchDoc]

### Parts
C52  100nF  [0603_CAP UF HD]
C53  100nF  [0603_CAP UF HD]
C54  100nF  [0603_CAP UF HD]
J4  HDMI Connector  [A35071TR-ND]
P3  Digitiser Jumper  [CONNECTOR FPC MOLEX 51281-0694]
R76  10k  [0603-RESISTOR HD]
R78  10k  [0603-RESISTOR HD]
R79  10k  [0603-RESISTOR HD]
U26  LCD Connector  [Connector FPC 40 pin TE 4-1734839-0]
U27  TPD12S016PWR  [SOP65P640X120-24N]

### Ports
BACKLIGHT+ (in), BACKLIGHT- (out), BLU0_LCD (in), BLU1_LCD (in), BLU2_LCD (in), BLU3_LCD (in), BLU4_LCD (in), BLU5_LCD (in), CEC_A (out), CT_HPD (out), DCLK_LCD (in), DEN_LCD (in), GRN0_LCD (in), GRN1_LCD (in), GRN2_LCD (in), GRN3_LCD (in), GRN4_LCD (in), GRN5_LCD (in), HDMI_EN (out), HDMI_TX0_N (out), HDMI_TX0_P (out), HDMI_TX1_N (out), HDMI_TX1_P (out), HDMI_TX2_N (out), HDMI_TX2_P (out), HDMI_TXC_N (out), HDMI_TXC_P (out), HSYNC_LCD (in), LCD_STBY (in), RED0_LCD (in), RED1_LCD (in), RED2_LCD (in), RED3_LCD (in), RED4_LCD (in), RED5_LCD (in), SCL_A (out), SCL_T (in), SDA_A (out), SDA_T (out), VSYNC_LCD (in)

### Nets
5V_HDMI_A: C54.1 U27.11(VCC5V)  [also labelled 5V_OUT]
GND: C52.1 C53.2 C54.2 J4.2(Data2_Shield) J4.5(Data1_Shield) J4.8(Data0_Shield) J4.11(Clock_Shield) J4.17(DDC/CEC_GND) J4.H1(FRAME) J4.H2(FRAME) J4.H3(FRAME) J4.H4(FRAME) P3.6 U26.3(GND) U26.5(R0) U26.6(R1) U26.13(G0) U26.14(G1) U26.21(B0) U26.22(B1) U26.29(GND) U26.35(NC) U26.36(GND) U26.37(NC) U26.38(NC) U26.39(NC) U26.40(NC) U27.6(GND) U27.14(GND) U27.19(GND)
VCC_FPGA: C52.2 R78.2 R79.2 U27.24(VCCA)
VCC_Screen: P3.4 P3.5 R76.1 U26.4(VDD)
5V_HDMI_B: C53.1 J4.18(+5V) U27.13(5V_OUT)
CEC_A: U27.1(CEC_A) ; port CEC_A
CEC_B: J4.13(CEC) U27.7(CEC_B)
CT_HPD: U27.12(CT_HPD) ; port CT_HPD
HDMI_EN: U27.4(HPD_A) U27.5(LS_OE) ; port HDMI_EN  [also labelled HPD_A, LS_OE]
HDMI_TX0_N: J4.9(Data0-) U27.17(D0-) ; port HDMI_TX0_N
HDMI_TX0_P: J4.7(Data0+) U27.18(D0+) ; port HDMI_TX0_P
HDMI_TX1_N: J4.6(Data1-) U27.20(D1-) ; port HDMI_TX1_N
HDMI_TX1_P: J4.4(Data1+) U27.21(D1+) ; port HDMI_TX1_P
HDMI_TX2_N: J4.3(Data2-) U27.22(D2-) ; port HDMI_TX2_N
HDMI_TX2_P: J4.1(Data2+) U27.23(D2+) ; port HDMI_TX2_P
HDMI_TXC_N: J4.12(Clock-) U27.15(CLK-) ; port HDMI_TXC_N
HDMI_TXC_P: J4.10(Clock+) U27.16(CLK+) ; port HDMI_TXC_P
HPD_B: J4.19(Hot_Plug_Detect) U27.10(HPD_B)
SCL_A: R78.1 U27.2(SCL_A) ; port SCL_A
SCL_B: J4.15(SCL) U27.8(SCL_B)
SDA_A: R79.1 U27.3(SDA_A) ; port SDA_A
SDA_B: J4.16(SDA) U27.9(SDA_B)
NetC36_1: U26.2(VLED+) ; port BACKLIGHT+
NetC39_1: U26.1(VLED-) ; port BACKLIGHT-
NetP3_1: P3.1 ; port SCL_T
NetP3_2: P3.2 ; port SDA_T
NetR76_2: R76.2 U26.31(STBYB) ; port LCD_STBY
NetU9_12B: U26.33(VSYNC) ; port VSYNC_LCD
NetU9_13B: U26.32(HSYNC) ; port HSYNC_LCD
NetU9_14B: U26.30(DCLK) ; port DCLK_LCD
NetU9_15B: U26.28(B7) ; port BLU5_LCD
NetU9_16B: U26.27(B6) ; port BLU4_LCD
NetU9_17B: U26.26(B5) ; port BLU3_LCD
NetU9_18B: U26.25(B4) ; port BLU2_LCD
NetU9_19B: U26.24(B3) ; port BLU1_LCD
NetU9_20B: U26.23(B2) ; port BLU0_LCD
NetU9_21B: U26.20(G7) ; port GRN5_LCD
NetU9_22B: U26.19(G6) ; port GRN4_LCD
NetU9_23B: U26.18(G5) ; port GRN3_LCD
NetU9_24B: U26.17(G4) ; port GRN2_LCD
NetU9_25B: U26.16(G3) ; port GRN1_LCD
NetU9_26B: U26.15(G2) ; port GRN0_LCD
NetU9_27B: U26.12(R7) ; port RED5_LCD
NetU9_28B: U26.11(R6) ; port RED4_LCD
NetU9_29B: U26.10(R5) ; port RED3_LCD
NetU9_30B: U26.9(R4) ; port RED2_LCD
NetU9_31B: U26.8(R3) ; port RED1_LCD
NetU9_32B: U26.7(R2) ; port RED0_LCD
NetU13_7: U26.34(DEN) ; port DEN_LCD

Not connected (* = marked no-connect by the designer): J4 14(NC)*; P3 3

### Notes on the sheet
- FPC Straight-Thru to allow connection of touch digitiser via ribbon cable for different screens
- External VGA & LCD VGA
- 4
- 17
- Lachlan McDonald
- Title
- Size:
- Date:
- A4
- Number:
- Revision:
- Sheet
- Drawn By:
- of
- File:

### Library data of the parts
C52-C54 = Cap: Capacitor; Value: 100nF
J4 = HDMI: HDMI Buchse 19Pol. 90°; AN: 26642; Trenz-Stock: Yes; Mixed: SMT; H-ART: 685119134923; Temperature-Range: -25/+85; Extra: WE685119134923; Case: HDMI; HelpURL: B:\AD\adlib\datasheet\685119134923
P3 = Header 3X2: Header, 3-Pin, Dual row; Manufacturer: Hirose; Manufacturer Number: FH12-6S-0.5SH(55); Element 14 Part Number: 1324538; Digikey Number: HFJ106CT-ND
R76 R78 R79 = Resistor: Value: 10k
U26 = LCD Connector: Manufacturer: Hirose; Manufacturer Number: FH12A-40S-0.5SH(55); Element 14 Part Number: 1324569; Digikey Number: HFK140CT-ND
U27 = TPD12S016PWR: AN: 25112; Trenz-Stock: Yes; Mixed: SMT; Extra: HDMI Companion Chip with I2C Level Shifting Buffer, 12 Channel ESD; Case: TSSOP24; HelpURL: B:\AD\adlib\datasheet\TPD12S016; H-ART: TPD12S016PWR

## Sheet Battery.SchDoc: TITLE
size A4; DrawnBy: D Kleiss; Organization: Flinders University; Address1: College of Science & Engineering; Address2: Engineering Services Room 3.22; Address3: 1284 South Rd; Address4: SA 5042; DocumentNumber: A4; Revision: 1; SheetNumber: 1; SheetTotal: 1
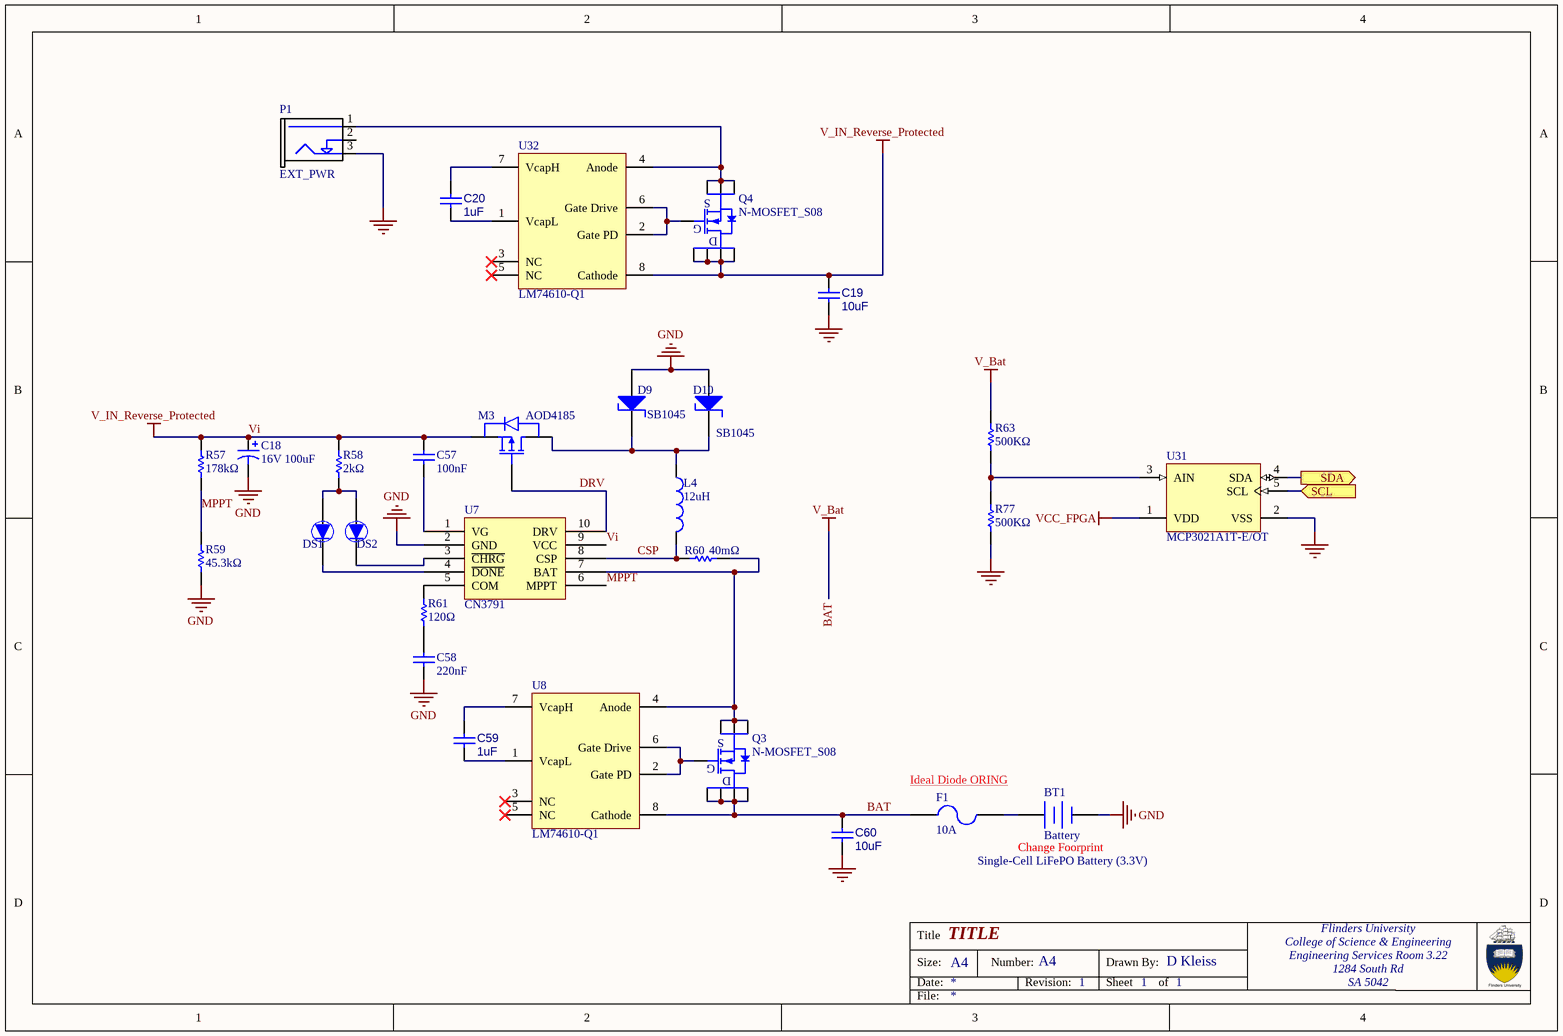
[diagram p3: Battery.SchDoc]

### Parts
BT1  Battery  [CONNECTOR PHOENIX 1757242]
C18  16V 100uF  [KEMT-T491-D_L]
C19  10uF  [0603_CAP UF HD]
C20  1uF  [0603_CAP UF HD]
C57  100nF  [0603_CAP UF HD]
C58  220nF  [0603_CAP UF HD]
C59  1uF  [0603_CAP UF HD]
C60  10uF  [0603_CAP UF HD]
D9  SB1045  [FP-95570-MFG]
D10  SB1045  [FP-95570-MFG]
DS1  LED  [3.2X1.6X1.1]  (value not drawn)
DS2  LED  [3.2X1.6X1.1]  (value not drawn)
F1  10A  [FUSE OMF125]
L4  12uH  [WE-PD-L]
M3  AOD4185  [FP-C04-189-MFG]
P1  EXT_PWR  [DCPOWER - P0620]
Q3  N-MOSFET_S08  [SOIC-8-H_SLDR]
Q4  N-MOSFET_S08  [SOIC-8-H_SLDR]
R57  178kΩ  [1608[0603]]
R58  2kΩ  [1608[0603]]
R59  45.3kΩ  [1608[0603]]
R60  40mΩ  [0603-RESISTOR HD]
R61  120Ω  [1608[0603]]
R63  500KΩ  [0603-RESISTOR HD]
R77  500KΩ  [0603-RESISTOR HD]
U7  CN3791  [SSOP10]
U8  LM74610-Q1  [TI-DGK8_V]
U31  MCP3021A1T-E/OT  [SOT-23-OT5_M]
U32  LM74610-Q1  [TI-DGK8_V]

### Ports
SCL (in), SDA (out)

### Nets
GND: BT1.2(-) C18.2 C19.2 C58.1 C60.2 D9.1(A) D10.1(A) P1.3 R59.1 R77.2 U7.2(GND) U31.2(VSS)
V_Bat: R63.1
VCC_FPGA: U31.1(VDD)
Vi: C18.1 C19.1 C57.2 M3.3(S) Q4.5(D) Q4.6(D) Q4.7(D) Q4.8(D) R57.2 R58.2 U7.9(VCC) U32.8(Cathode)  [also labelled V_IN_Reverse_Protected]
BAT: C60.1 F1.2 Q3.5(D) Q3.6(D) Q3.7(D) Q3.8(D) U8.8(Cathode)
CSP: L4.2 R60.2 U7.8(CSP)
DRV: M3.1(G) U7.10(DRV)
MPPT: R57.1 R59.2 U7.6(MPPT)
SCL: U31.5(SCL) ; port SCL
SDA: U31.4(SDA) ; port SDA
NetBT1_1: BT1.1(+) F1.1
NetC20_1: C20.1 U32.7(VcapH)
NetC20_2: C20.2 U32.1(VcapL)
NetC57_1: C57.1 U7.1(VG)
NetC58_2: C58.2 R61.1
NetC59_1: C59.1 U8.7(VcapH)
NetC59_2: C59.2 U8.1(VcapL)
NetD9_2: D9.2(K) D10.2(K) L4.1 M3.2(D)
NetDS1_1: DS1.1(A) DS2.1(A) R58.1
NetDS1_2: DS1.2(K) U7.4(~{DONE})
NetDS2_2: DS2.2(K) U7.3(~{CHRG})
NetP1_1: P1.1 Q4.1(S) Q4.2(S) Q4.3(S) U32.4(Anode)
NetQ3_1: Q3.1(S) Q3.2(S) Q3.3(S) R60.1 U7.7(BAT) U8.4(Anode)
NetQ3_4: Q3.4(G) U8.2(Gate_PD) U8.6(Gate_Drive)
NetQ4_4: Q4.4(G) U32.2(Gate_PD) U32.6(Gate_Drive)
NetR61_2: R61.2 U7.5(COM)
NetR63_2: R63.2 R77.1 U31.3(AIN)

Not connected (* = marked no-connect by the designer): P1 2; U8 3(NC)* 5(NC)*; U32 3(NC)* 5(NC)*

### Notes on the sheet
- Ideal Diode ORING
- (near BT1) Change Foorprint
- Single-Cell LiFePO Battery (3.3V)
- Labels drawn without touching a wire or pin: BAT
- Title
- Size:
- Date:
- A4
- Number:
- Revision:
- Sheet
- Drawn By:
- of
- File:

### Library data of the parts
BT1 = Battery: Multicell Battery; Manufacturer: Phoenix; Manufacturer Number: 1757242; Digikey Number: 277-1106-ND
C18 = cap: 有極性電容
C19 C60 = Cap: Capacitor; Manufacturer: Murata; Manufacturer Number: GRM188D71A106MA73D; Value: 10uF; Digikey Number: 490-7200-1-ND
C20 C59 = Cap: Capacitor; Manufacturer: Samsung; Manufacturer Number: CL10B105MO8NNWC; Value: 1uF; Digikey Number: 1276-6524-1-ND
C57 C58 = cap2
D9 D10 = SB1045: 10.0A SCHOTTKY BARRIER RECTIFIER
F1 = Fuse: Manufacturer: Schurter Inc.; Manufacturer Number: 3404.0021.11; Digikey Number: 486-2999-ND; Value: 10A
L4 = inductor_1
M3 = AOD4185: P-Channel Enhancement Mode Field Effect Transistor; pin to pad: 2>4
P1 = DCPOWER: 2.1mm DC JACK; Manufacturer: Wurth Electronics Inc.; Manufacturer Number: 694106301002; Digikey Number: 732-5930-ND
Q3 Q4 = N-MOSFET_S08: N-Mosfet SOIC-8; Digikey Number: RS1G120MNTBCT-ND
R57-R59 R61 = Res: Resistor; Published: 8-Jun-2000; LatestRevisionDate: 17-Jul-2002; LatestRevisionNote: Re-released for DXP Platform.; PackageReference: AXIAL-0.3; Publisher: Altium Limited
R60 R63 R77 = Res: R sense
U7 = CN3791: 4A, Standalone Li-ion Battery Charger IC  With Photovoltaic Cell MPPT Function
U8 U32 = LM74610-Q1: Zero IQ Reverse Polarity Protection Smart Diode Controller
U31 = CMP-0188-01201-1: Low Power 10-Bit A/D Converter With I2C Interface, 5-Pin SOT-23, Extended Temperature, Tape and Reel; ComponentLink2URL: http://ww1.microchip.com/downloads/en/DeviceDoc/21805a.pdf; PackageDescription: 5-Lead Plastic Small Outline Transistor (OT) [SOT-23]; PackageVersion: revBB, Aug-2009; DatasheetVersion: revA, May-2003; ComponentLink2Description: Datasheet; ComponentLink1Description: Manufacturer URL; PackageReference: SOT-23-OT5; ComponentLink3Description: Package Specification; Code_IPC: SOT23-5; ComponentLink3URL: http://www.microchip.com/stellent/groups/techpub_sg/documents/packagingspec/en012702.pdf; ComponentLink1URL: http://www.microchip.com/

## Sheet Power Control.SchDoc: Power Control
size A4; DrawnBy: D KLEISS; DocumentNumber: A4284; Revision: 1; SheetNumber: 11; SheetTotal: 15; PageSetup: Record=PageOptions|CenterHorizontal=True|CenterVertical=True|PrintScale=2.56|XCorrection=1.00|YCorrection=1.00|PrintKind=0|BorderSize=5000000|LeftOffset=0|BottomOffset=0|Orientation=2|PaperLength=1000|PaperWidth=1000|Scale=100|PaperSource=7|PrintQuality=-3|MediaType=1|DitherType=10|PrintScaleMode=1|PaperKind=A4 (210 x 297mm)|PaperIndex=9
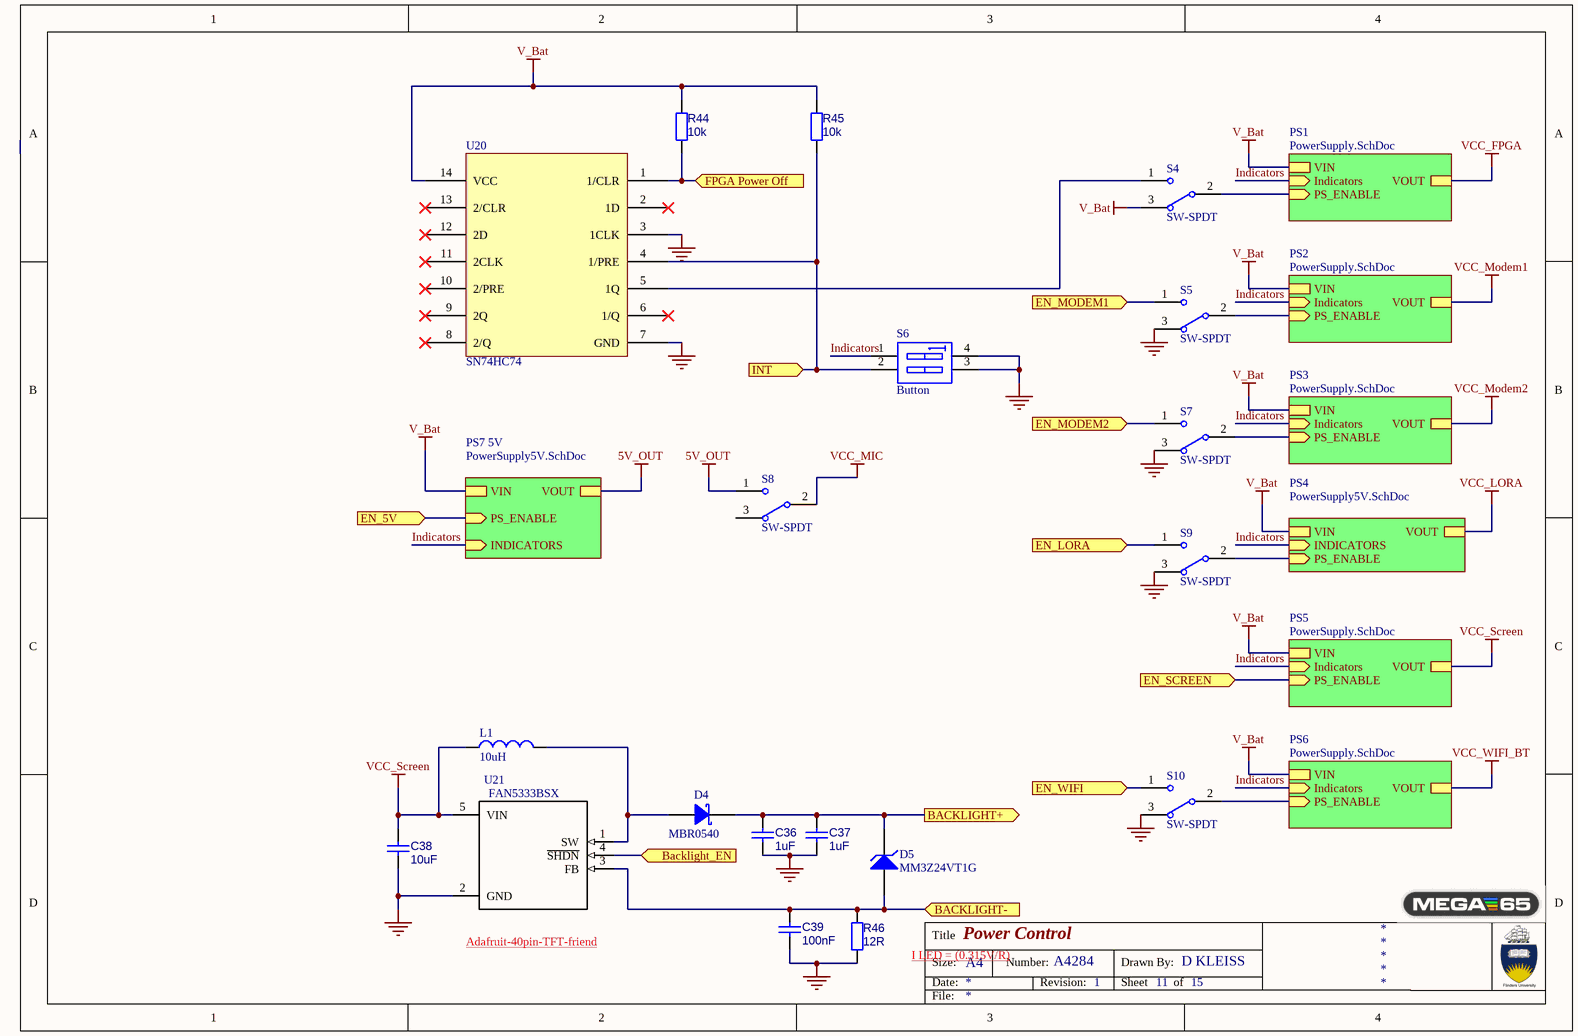
[diagram p4: Power Control.SchDoc]

### Parts
C36  1uF  [0603_CAP UF HD]
C37  1uF  [0603_CAP UF HD]
C38  10uF  [0603_CAP UF HD]
C39  100nF  [0603_CAP UF HD]
D4  MBR0540  [ONSC-SOD-123-2-425-04_V]
D5  MM3Z24VT1G  [ONSC-SOD-323-2-477-02_V]
L1  value 10uH  [TDK-SLF-6025-2_V]  (hidden comment: Inductor)
R44  10k  [0603-RESISTOR HD]
R45  10k  [0603-RESISTOR HD]
R46  12R  [0805 Reflow]
S4  SW-SPDT  [Switch SPDT OS102011MA1Q]
S5  SW-SPDT  [Switch SPDT OS102011MA1Q]
S6  Button  [Buttons Gameboy v2]
S7  SW-SPDT  [Switch SPDT OS102011MA1Q]
S8  SW-SPDT  [Switch SPDT OS102011MA1Q]
S9  SW-SPDT  [Switch SPDT OS102011MA1Q]
S10  SW-SPDT  [Switch SPDT OS102011MA1Q]
U20  SN74HC74  [SOIC-14]
U21  FAN5333BSX  [SOT-23-5]

### Sub-sheets
PS1 = PowerSupply.SchDoc: Indicators (in), VOUT, PS_ENABLE (in), VIN
PS2 = PowerSupply.SchDoc: Indicators (in), VOUT, PS_ENABLE (in), VIN
PS3 = PowerSupply.SchDoc: Indicators (in), VOUT, PS_ENABLE (in), VIN
PS4 = PowerSupply5V.SchDoc: VIN, PS_ENABLE (in), INDICATORS (in), VOUT
PS5 = PowerSupply.SchDoc: Indicators (in), VOUT, PS_ENABLE (in), VIN
PS6 = PowerSupply.SchDoc: Indicators (in), VOUT, PS_ENABLE (in), VIN
PS7 5V = PowerSupply5V.SchDoc: VIN, PS_ENABLE (in), INDICATORS (in), VOUT

### Ports
BACKLIGHT+ (out), BACKLIGHT- (in), Backlight_EN (in), EN_5V (in), EN_LORA (in), EN_MODEM1 (in), EN_MODEM2 (in), EN_SCREEN (in), EN_WIFI (in), FPGA Power Off (in), INT (in)

### Nets
5V_OUT: S8.1 ; sheet PS7 5V/VOUT  [project net 5V_HDMI_A]
GND: C36.2 C37.2 C38.2 C39.2 R46.2 S5.3 S6.3(B2) S6.4(B1) S7.3 S9.3 S10.3 U20.3(1CLK) U20.7(GND) U21.2(GND)
V_Bat: R44.1 R45.1 S4.3 U20.14(VCC) ; sheet PS1/VIN, sheet PS2/VIN, sheet PS3/VIN, sheet PS5/VIN, sheet PS6/VIN, sheet PS7 5V/VIN, sheet PS4/VIN
VCC_MIC: S8.2
VCC_Screen: C38.1 L1.1 U21.5(VIN) ; sheet PS5/VOUT
EN_5V: port EN_5V, sheet PS7 5V/PS_ENABLE
FPGA Power Off: R44.2 U20.1(1/CLR) ; port FPGA Power Off
Indicators: S6.1(A1) ; sheet PS1/Indicators, sheet PS2/Indicators, sheet PS3/Indicators, sheet PS5/Indicators, sheet PS6/Indicators, sheet PS7 5V/INDICATORS, sheet PS4/INDICATORS
INT: R45.2 S6.2(A2) U20.4(1/PRE) ; port INT
NetC36_1: C36.1 C37.1 D4.2(K) D5.3(K) ; port BACKLIGHT+
NetC39_1: C39.1 D5.1(A) R46.1 U21.3(FB) ; port BACKLIGHT-
NetD4_1: D4.1(A) L1.2 U21.1(SW)
NetS4_1: S4.1 U20.5(1Q)
NetS4_2: S4.2 ; sheet PS1/PS_ENABLE
NetS5_1: S5.1 ; port EN_MODEM1
NetS5_2: S5.2 ; sheet PS2/PS_ENABLE
NetS7_1: S7.1 ; port EN_MODEM2
NetS7_2: S7.2 ; sheet PS3/PS_ENABLE
NetS9_1: S9.1 ; port EN_LORA
NetS9_2: S9.2 ; sheet PS4/PS_ENABLE
NetS10_1: S10.1 ; port EN_WIFI
NetS10_2: S10.2 ; sheet PS6/PS_ENABLE
NetU13_8: U21.4(~{SHDN}) ; port Backlight_EN
NetU14_8: port EN_SCREEN, sheet PS5/PS_ENABLE

Not connected (* = marked no-connect by the designer): S8 3; U20 2(1D)* 6(1/Q)* 8(2/Q)* 9(2Q)* 10(2/PRE)* 11(2CLK)* 12(2D)* 13(2/CLR)*

### Notes on the sheet
- (near U21) Adafruit-40pin-TFT-friend
- I LED = (0.315V/R)
- Title
- Size:
- Date:
- A4
- Number:
- Revision:
- Sheet
- Drawn By:
- of
- File:

### Library data of the parts
C36 C37 = Cap: as C20 on sheet Battery; Value: 1uF; Digikey Number: 1276-6524-1-ND
C38 = Cap: as C19 on sheet Battery; Value: 10uF; Digikey Number: 490-7200-1-ND
C39 = Cap: Capacitor; Value: 100nF
D4 = DIODE_SCHOTTKY: Diode; Manufacturer: ON Semiconductor; Manufacturer Number: MBR0540; Digikey Number: MBR0540CT-ND
D5 = ZENER DIODE: pin to pad: 3>2; Manufacturer: ON Semiconductor; Manufacturer Number: MM3Z24VT1G; Digikey Number: MM3Z24VT1GOSCT-ND
L1 = Inductor: Manufacturer: TDK; Manufacturer Number: SLF6025T-100M1R0-PF; Digikey Number: 445-174416-1-ND
R44-R46 = Resistor
  R44 R45: Value: 10k
  R46: Value: 12R
S4 S5 S7-S10 = SW-SPDT: SPDT Subminiature Toggle Switch, Right Angle Mounting, Vertical Actuation; Manufacturer: C & K COMPONENTS; Manufacturer Number: OS102011MA1QN1; Digikey Number: CKN9559-ND; Element 14 Part Number: 1201431
S6 = SW DIP-2: DIP Switch, 2 Position, SPST
U20 = SN74HC74: Manufacturer: Texas Instruments; Manufacturer Number: SN74HC74DR; Digikey Number: 296-1204-1-ND
U21 = FAN5333BSX: FAN5333B Series 5.5 V 1.5 MHz High Efficiency High Current Serial LED Driver; Manufacturer: ON Semiconductor; Digikey Number: FAN5333BSXCT-ND; Manufacturer Number: FAN5333BSX

## Sheet PowerSupply.SchDoc: TITLE
size A4; DrawnBy: D Kleiss; Organization: Flinders University; Address1: College of Science & Engineering; Address2: Engineering Services Room 3.22; Address3: 1284 South Rd; Address4: SA 5042; DocumentNumber: A4; Revision: 1; SheetNumber: 1; SheetTotal: 1
Used 5 times, as channels Power Control/PS1, Power Control/PS2, Power Control/PS3, Power Control/PS5, Power Control/PS6. Parts and nets are listed once, with the designators drawn on the sheet.
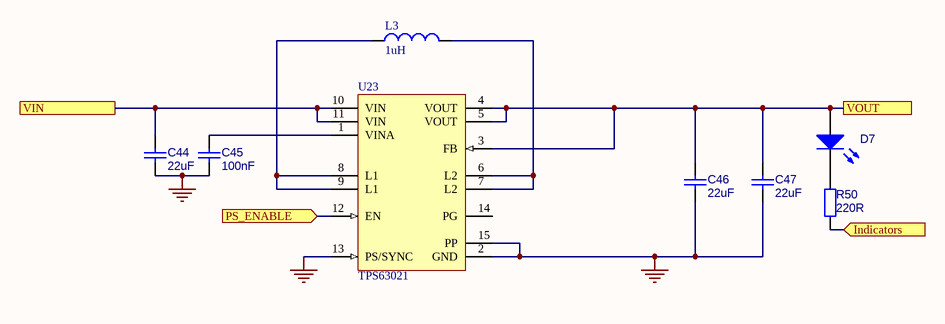
[diagram p5: PowerSupply.SchDoc]

### Parts
C44  22uF  [0603_CAP UF HD]
C45  100nF  [0603_CAP UF HD]
C46  22uF  [0603_CAP UF HD]
C47  22uF  [0603_CAP UF HD]
D7  (no value)  [LED 3mm Red]
L3  value 1uH  [252012]  (hidden comment: Inductor)
R50  220R  [0603-RESISTOR HD]
U23  TPS63021  [DSJ14-4000X1580TP_V]

### Ports
Indicators (in), PS_ENABLE (in), VIN, VOUT

### Nets
GND: C44.2 C45.2 C46.2 C47.2 U23.2(GND) U23.13(PS/SYNC) U23.15(PP)
Indicators: R50.2 ; port Indicators
PS_ENABLE: U23.12(EN) ; port PS_ENABLE
VIN: C44.1 U23.10(VIN) U23.11(VIN) ; port VIN
VOUT: C46.1 C47.1 D7.A U23.3(FB) U23.4(VOUT) U23.5(VOUT) ; port VOUT
NetC45_1: C45.1 U23.1(VINA)
NetD7_K: D7.K R50.1
NetL3_1: L3.1 U23.8(L1) U23.9(L1)
NetL3_2: L3.2 U23.6(L2) U23.7(L2)

Not connected (* = marked no-connect by the designer): U23 14(PG)

### Channels
Power Control/PS1: designators end in _PS1; ports Indicators=Indicators PS_ENABLE=NetS4_2 VIN=V_Bat VOUT=VCC_FPGA
Power Control/PS2: designators end in _PS2; ports Indicators=Indicators PS_ENABLE=NetS5_2 VIN=V_Bat VOUT=VCC_MODEM
Power Control/PS3: designators end in _PS3; ports Indicators=Indicators PS_ENABLE=NetS7_2 VIN=V_Bat VOUT=VCC_MODEM
Power Control/PS5: designators end in _PS5; ports Indicators=Indicators PS_ENABLE=NetU14_8 VIN=V_Bat VOUT=VCC_Screen
Power Control/PS6: designators end in _PS6; ports Indicators=Indicators PS_ENABLE=NetS10_2 VIN=V_Bat VOUT=VCC_WIFI_BT

### Notes on the sheet
- Title
- Size:
- Date:
- A4
- Number:
- Revision:
- Sheet
- Drawn By:
- of
- File:

### Library data of the parts
C44 C46 C47 = Cap: Capacitor; Manufacturer: MuRata; Manufacturer Number: GRM188R60J226MEA0D; Value: 22uF; Digikey Number: 490-7611-1-ND
C45 = Cap: Capacitor; Value: 100nF
D7 = LED: Manufacturer: *; Element 14 Part Number: *; Digikey Number: 732-5005-ND
L3 = Inductor: Manufacturer: Samsung Electro-Mechanics; Manufacturer Number: CIGW252010GL1R0MNE; Digikey Number: 1276-6932-1-ND
R50 = Resistor: Value: 220R
U23 = TPS63020DSJ14: High Efficiency Single Inductor Buck-Boost Converter, 4 A, 1.8 to 5.5 V Input, 1.2 to 5.5 V Output, -40 to 85 degC, 14-Pin VSON (DSJ), Green (RoHS & no Sb/Br), Tape and Reel; Manufacturer: Texas Instruments; Manufacturer Number: TPS63021; Digikey Number: 296-37448-1-ND‎

## Sheet PowerSupply5V.SchDoc
size A4
Used 2 times, as channels Power Control/PS7 5V, Power Control/PS4. Parts and nets are listed once, with the designators drawn on the sheet.
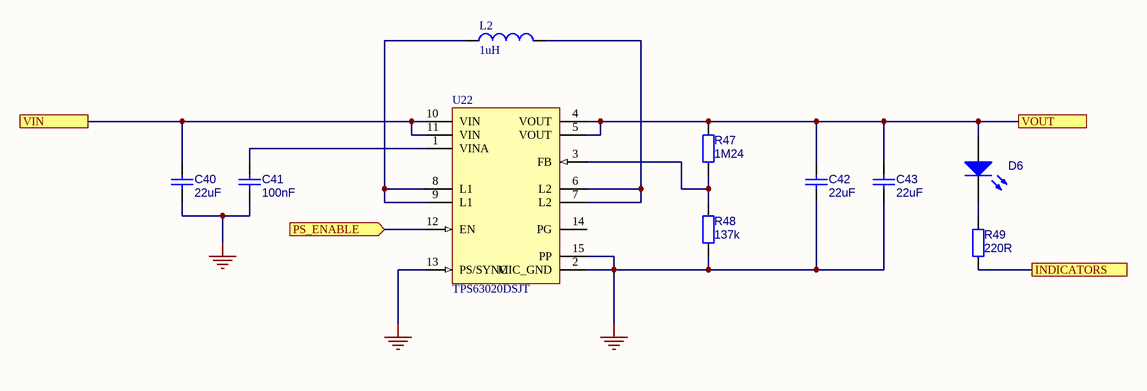
[diagram p6: PowerSupply5V.SchDoc]

### Parts
C40  22uF  [0603_CAP UF HD]
C41  100nF  [0603_CAP UF HD]
C42  22uF  [0603_CAP UF HD]
C43  22uF  [0603_CAP UF HD]
D6  (no value)  [LED 3mm Red]
L2  value 1uH  [252012]  (hidden comment: Inductor)
R47  1M24  [0603-RESISTOR HD]
R48  137k  [0603-RESISTOR HD]
R49  220R  [0603-RESISTOR HD]
U22  TPS63020DSJT  [DSJ14-4000X1580TP_V]

### Ports
INDICATORS, PS_ENABLE (in), VIN, VOUT

### Nets
GND: C40.2 C41.2 C42.2 C43.2 R48.2 U22.2(MIC_GND) U22.13(PS/SYNC) U22.15(PP)
INDICATORS: R49.2 ; port INDICATORS
PS_ENABLE: U22.12(EN) ; port PS_ENABLE
VIN: C40.1 U22.10(VIN) U22.11(VIN) ; port VIN
VOUT: C42.1 C43.1 D6.A R47.1 U22.4(VOUT) U22.5(VOUT) ; port VOUT
NetC41_1: C41.1 U22.1(VINA)
NetD6_K: D6.K R49.1
NetL2_1: L2.1 U22.8(L1) U22.9(L1)
NetL2_2: L2.2 U22.6(L2) U22.7(L2)
NetR47_2: R47.2 R48.1 U22.3(FB)

Not connected (* = marked no-connect by the designer): U22 14(PG)

### Channels
Power Control/PS7 5V: designators end in _PS7_5V; ports INDICATORS=Indicators PS_ENABLE=EN_5V VIN=V_Bat VOUT=5V_HDMI_A
Power Control/PS4: designators end in _PS4; ports INDICATORS=Indicators PS_ENABLE=NetS9_2 VIN=V_Bat VOUT=VCC_LORA

### Library data of the parts
C40 C42 C43 = Cap: as C44 on sheet PowerSupply; Value: 22uF; Digikey Number: 490-7611-1-ND
C41 = Cap: Capacitor; Value: 100nF
D6 = LED: Manufacturer: *; Element 14 Part Number: *; Digikey Number: 732-5005-ND
L2 = Inductor_1: Manufacturer: Samsung Electro-Mechanics; Manufacturer Number: CIGW252010GL1R0MNE; Digikey Number: 1276-6932-1-ND
R47-R49 = Resistor
  R47: Value: 1M24
  R48: Value: 137k
  R49: Value: 220R
U22 = TPS63020DSJ14: as U23 on sheet PowerSupply; Manufacturer Number: TPS63020; Digikey Number: 296-27230-1-ND‎

## Sheet I2C Expanders.SchDoc
size A3
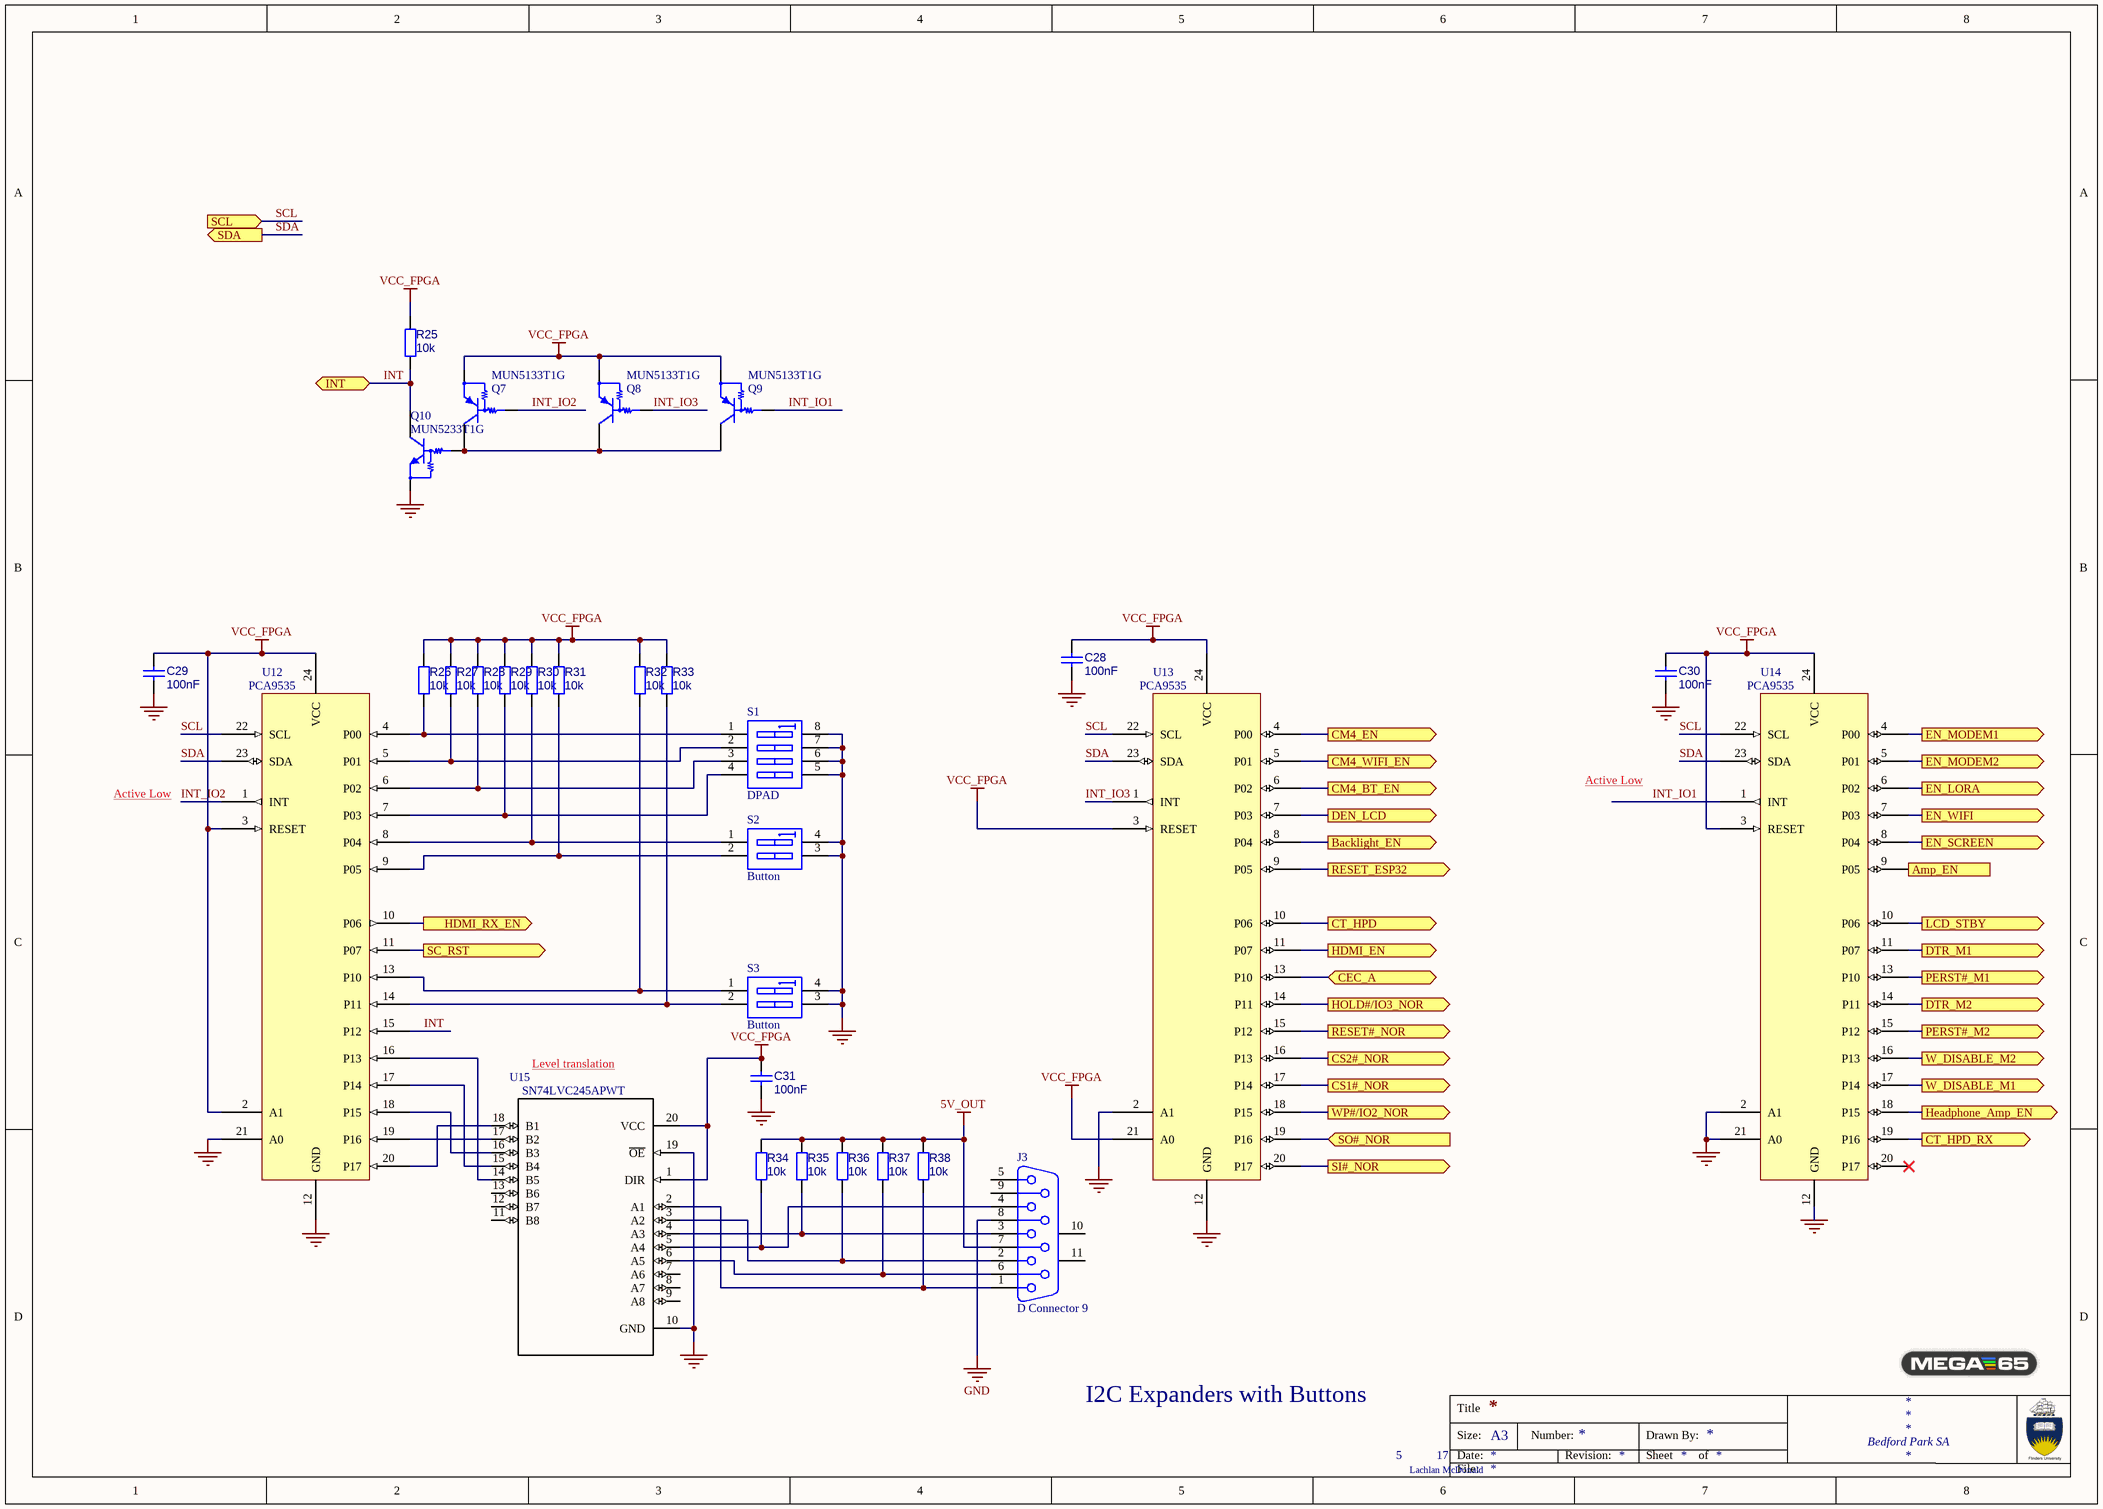
[diagram p7: I2C Expanders.SchDoc]

### Parts
C28  100nF  [0603_CAP UF HD]
C29  100nF  [0603_CAP UF HD]
C30  100nF  [0603_CAP UF HD]
C31  100nF  [0603_CAP UF HD]
J3  D Connector 9  [DB9 Right Angle Through-Hole Male]
Q7  MUN5133T1G  [SC70-3 (SOT-323)]
Q8  MUN5133T1G  [SC70-3 (SOT-323)]
Q9  MUN5133T1G  [SC70-3 (SOT-323)]
Q10  MUN5233T1G  [SC70-3 (SOT-323)]
R25  10k  [0603-RESISTOR HD]
R26  10k  [0603-RESISTOR HD]
R27  10k  [0603-RESISTOR HD]
R28  10k  [0603-RESISTOR HD]
R29  10k  [0603-RESISTOR HD]
R30  10k  [0603-RESISTOR HD]
R31  10k  [0603-RESISTOR HD]
R32  10k  [0603-RESISTOR HD]
R33  10k  [0603-RESISTOR HD]
R34  10k  [0603-RESISTOR HD]
R35  10k  [0603-RESISTOR HD]
R36  10k  [0603-RESISTOR HD]
R37  10k  [0603-RESISTOR HD]
R38  10k  [0603-RESISTOR HD]
S1  DPAD  [DPAD Gameboy V2]
S2  Button  [Buttons Gameboy v2]
S3  Button  [Buttons Gameboy v2]
U12  PCA9535  [PW0024A_M]
U13  PCA9535  [PW0024A_M]
U14  PCA9535  [PW0024A_M]
U15  SN74LVC245APWT  [DGV20_M]

### Ports
Amp_EN (out), Backlight_EN (out), CEC_A (bidir), CM4_BT_EN (out), CM4_EN (out), CM4_WIFI_EN (out), CS1#_NOR (out), CS2#_NOR (out), CT_HPD (out), CT_HPD_RX (out), DEN_LCD (out), DTR_M1 (out), DTR_M2 (out), EN_LORA (out), EN_MODEM1 (out), EN_MODEM2 (out), EN_SCREEN (out), EN_WIFI (out), HDMI_EN (out), HDMI_RX_EN (out), Headphone_Amp_EN (out), HOLD#/IO3_NOR (out), INT (bidir), LCD_STBY (out), PERST#_M1 (out), PERST#_M2 (out), RESET#_NOR (out), RESET_ESP32 (out), SC_RST (out), SCL (in), SDA (out), SI#_NOR (out), SO#_NOR (in), W_DISABLE_M1 (out), W_DISABLE_M2 (out), WP#/IO2_NOR (out)

### Nets
5V_OUT: J3.7 R34.1 R35.1 R36.1 R37.1 R38.1  [project net 5V_HDMI_A]
GND: C28.2 C29.2 C30.2 C31.2 J3.8 Q10.1(E) S1.5(B4) S1.6(B3) S1.7(B2) S1.8(B1) S2.3(B2) S2.4(B1) S3.3(B2) S3.4(B1) U12.12(GND) U12.21(A0) U13.2(A1) U13.12(GND) U14.2(A1) U14.12(GND) U14.21(A0) U15.10(GND) U15.19(~{OE})
VCC_FPGA: C28.1 C29.1 C30.1 C31.1 Q7.2(E) Q8.2(E) Q9.2(E) R25.2 R26.1 R27.1 R28.1 R29.1 R30.1 R31.1 R32.1 R33.1 U12.2(A1) U12.3(RESET) U12.24(VCC) U13.3(RESET) U13.21(A0) U13.24(VCC) U14.3(RESET) U14.24(VCC) U15.1(DIR) U15.20(VCC)
CEC_A: U13.13(P10) ; port CEC_A
CT_HPD: U13.10(P06) ; port CT_HPD
HDMI_EN: U13.11(P07) ; port HDMI_EN
INT: Q10.3(C) R25.1 U12.15(P12) ; port INT
INT_IO1: Q9.1(B) U14.1(INT)
INT_IO2: Q7.1(B) U12.1(INT)
INT_IO3: Q8.1(B) U13.1(INT)
RESET_ESP32: U13.9(P05) ; port RESET_ESP32
SCL: U12.22(SCL) U13.22(SCL) U14.22(SCL) ; port SCL
SDA: U12.23(SDA) U13.23(SDA) U14.23(SDA) ; port SDA
NetCM1_89: U13.5(P01) ; port CM4_WIFI_EN
NetCM1_91: U13.6(P02) ; port CM4_BT_EN
NetCM1_99: U13.4(P00) ; port CM4_EN
NetESP1_5: U14.9(P05) ; port Amp_EN
NetJ3_1: J3.1 R38.2 U15.2(A1)
NetJ3_2: J3.2 R36.2 U15.3(A2)
NetJ3_3: J3.3 R35.2 U15.4(A3)
NetJ3_4: J3.4 R34.2 U15.5(A4)
NetJ3_6: J3.6 R37.2 U15.6(A5)
NetQ7_3: Q7.3(C) Q8.3(C) Q9.3(C) Q10.2(B)
NetR26_2: R26.2 S1.1(A1) U12.4(P00)
NetR27_2: R27.2 S1.2(A2) U12.5(P01)
NetR28_2: R28.2 S1.3(A3) U12.6(P02)
NetR29_2: R29.2 S1.4(A4) U12.7(P03)
NetR30_2: R30.2 S2.1(A1) U12.8(P04)
NetR31_2: R31.2 S2.2(A2) U12.9(P05)
NetR32_2: R32.2 S3.1(A1) U12.13(P10)
NetR33_2: R33.2 S3.2(A2) U12.14(P11)
NetR76_2: U14.10(P06) ; port LCD_STBY
NetS5_1: U14.4(P00) ; port EN_MODEM1
NetS7_1: U14.5(P01) ; port EN_MODEM2
NetS9_1: U14.6(P02) ; port EN_LORA
NetS10_1: U14.7(P03) ; port EN_WIFI
NetU1_M1_20: U14.17(P14) ; port W_DISABLE_M1
NetU1_M1_22: U14.13(P10) ; port PERST#_M1
NetU1_M1_31: U14.11(P07) ; port DTR_M1
NetU1_M2_20: U14.16(P13) ; port W_DISABLE_M2
NetU1_M2_22: U14.15(P12) ; port PERST#_M2
NetU1_M2_31: U14.14(P11) ; port DTR_M2
NetU10_1: U13.14(P11) ; port HOLD#/IO3_NOR
NetU10_3: U13.15(P12) ; port RESET#_NOR
NetU10_6: U13.16(P13) ; port CS2#_NOR
NetU10_7: U13.17(P14) ; port CS1#_NOR
NetU10_8: U13.19(P16) ; port SO#_NOR
NetU10_9: U13.18(P15) ; port WP#/IO2_NOR
NetU10_15: U13.20(P17) ; port SI#_NOR
NetU11_FA_5: U14.18(P15) ; port Headphone_Amp_EN
NetU12_10: U12.10(P06) ; port HDMI_RX_EN
NetU12_11: U12.11(P07) ; port SC_RST
NetU12_16: U12.16(P13) U15.14(B5)
NetU12_17: U12.17(P14) U15.15(B4)
NetU12_18: U12.18(P15) U15.16(B3)
NetU12_19: U12.19(P16) U15.17(B2)
NetU12_20: U12.20(P17) U15.18(B1)
NetU13_7: U13.7(P03) ; port DEN_LCD
NetU13_8: U13.8(P04) ; port Backlight_EN
NetU14_8: U14.8(P04) ; port EN_SCREEN
NetU14_19: U14.19(P16) ; port CT_HPD_RX

Not connected (* = marked no-connect by the designer): J3 5 9 10(MH1) 11(MH2); U14 20(P17)*; U15 7(A6) 8(A7) 9(A8) 11(B8) 12(B7) 13(B6)

### Notes on the sheet
- Active Low
- Level translation
- I2C Expanders with Buttons
- 5
- 17
- Lachlan McDonald
- Title
- Size:
- Date:
- A3
- Number:
- Revision:
- Sheet
- Drawn By:
- of
- Bedford Park SA
- File:

### Library data of the parts
C28-C31 = Cap: Capacitor; Value: 100nF
J3 = D Connector 9: Receptacle Assembly, 9 Position, Right Angle; Manufacturer: Assman WSW; Manufacturer Number: A-DS 09 A/KG-T2S; Digikey Number: AE10968-ND
Q7-Q9 = Transistor PNP Prebiased: PNP Bipolar Transistor, Prebiased; Manufacturer: ON Semiconductor; Manufacturer Number: MUN5133T1G; Digikey Number: MUN5133T1GOSCT-ND
Q10 = Transistor NPN Prebiased: NPN Bipolar Transistor, Prebiased; Manufacturer: ON Semiconductor; Manufacturer Number: MUN5233T1G; Digikey Number: MUN5233T1GOSCT-ND
R25-R38 = Resistor: Value: 10k
S1 = SW DIP-4: DIP Switch, 4 Position, SPST
S2 S3 = SW DIP-2: DIP Switch, 2 Position, SPST
U12-U14 = TCA9539: Manufacturer: NXP; Manufacturer Number: PCA9535APW,118; Digikey Number: 568-9913-1-ND
U15 = SN74LVC245APWT: Octal Bus Transceiver With 3-State Outputs 20-TSSOP -40 to 125; Manufacturer: Texas Instruments; Digikey Number: 296-49918-1-ND; Manufacturer Number: SN74LVC245APWT

## Sheet MEMS MICs.SchDoc
size A4
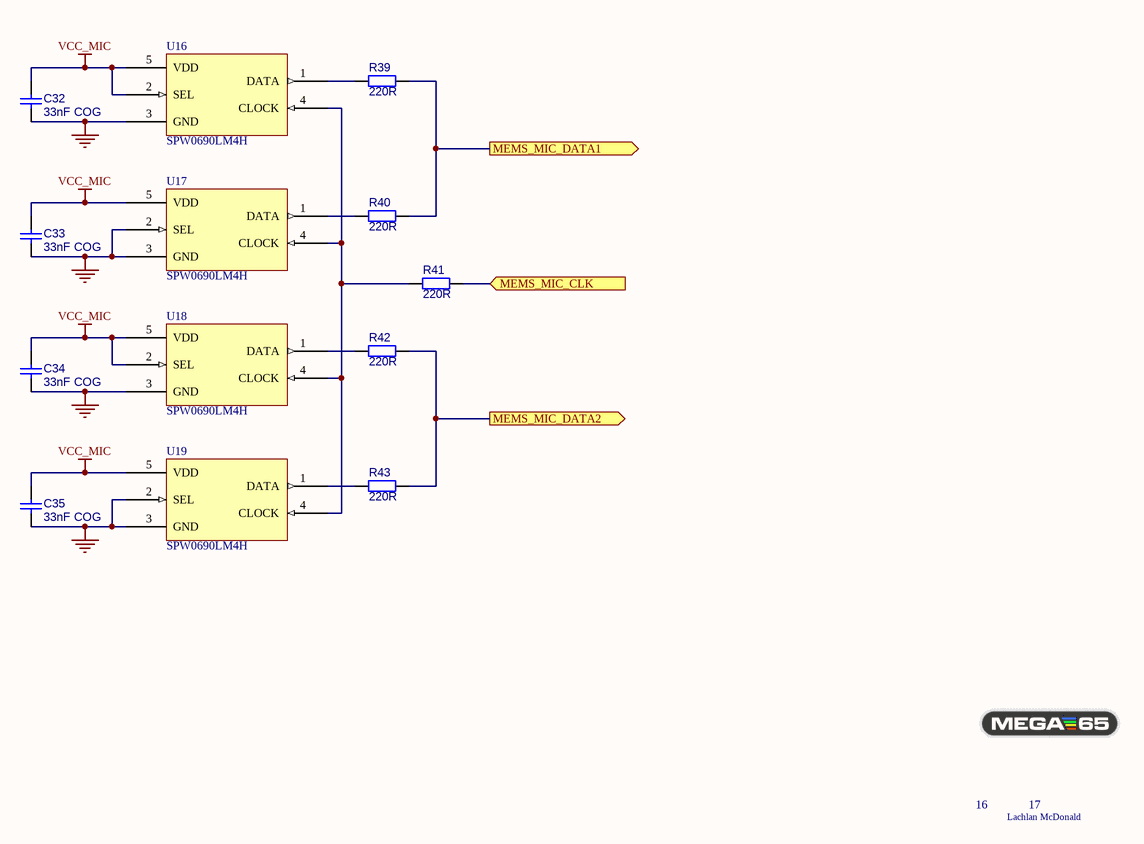
[diagram p8: MEMS MICs.SchDoc]

### Parts
C32  33nF COG  [0805 Reflow Cap]
C33  33nF COG  [0805 Reflow Cap]
C34  33nF COG  [0805 Reflow Cap]
C35  33nF COG  [0805 Reflow Cap]
R39  220R  [0603-RESISTOR HD]
R40  220R  [0603-RESISTOR HD]
R41  220R  [0603-RESISTOR HD]
R42  220R  [0603-RESISTOR HD]
R43  220R  [0603-RESISTOR HD]
U16  SPW0690LM4H  [MICROPHONE MEMS SPW0690LM4H-1]
U17  SPW0690LM4H  [MICROPHONE MEMS SPW0690LM4H-1]
U18  SPW0690LM4H  [MICROPHONE MEMS SPW0690LM4H-1]
U19  SPW0690LM4H  [MICROPHONE MEMS SPW0690LM4H-1]

### Ports
MEMS_MIC_CLK (in), MEMS_MIC_DATA1 (out), MEMS_MIC_DATA2 (out)

### Nets
GND: C32.2 C33.2 C34.2 C35.2 U16.3(GND) U17.2(SEL) U17.3(GND) U18.3(GND) U19.2(SEL) U19.3(GND)
VCC_MIC: C32.1 C33.1 C34.1 C35.1 U16.2(SEL) U16.5(VDD) U17.5(VDD) U18.2(SEL) U18.5(VDD) U19.5(VDD)
NetR39_1: R39.1 R40.1 ; port MEMS_MIC_DATA1
NetR39_2: R39.2 U16.1(DATA)
NetR40_2: R40.2 U17.1(DATA)
NetR41_1: R41.1 ; port MEMS_MIC_CLK
NetR41_2: R41.2 U16.4(CLOCK) U17.4(CLOCK) U18.4(CLOCK) U19.4(CLOCK)
NetR42_1: R42.1 R43.1 ; port MEMS_MIC_DATA2
NetR42_2: R42.2 U18.1(DATA)
NetR43_2: R43.2 U19.1(DATA)

### Notes on the sheet
- 16
- 17
- Lachlan McDonald
- Title
- Size:
- Date:
- A4
- Number:
- Revision:
- Sheet
- Drawn By:
- of
- File:

### Library data of the parts
C32-C35 = Cap: Capacitor; Manufacturer: TDK Corporation; Manufacturer Number: CGJ4J2C0G1H333J125AA; Value: 33nF COG; Digikey Number: 445-8162-1-ND
R39-R43 = Resistor: Value: 220R
U16-U19 = MEMs Microphone: Manufacturer: Knowles; Manufacturer Number: SPW0690LM4H-1; Digikey Number: 423-1423-1-ND